# Altium project SDC_V2.1.PrjPcb (part 1 of 4)
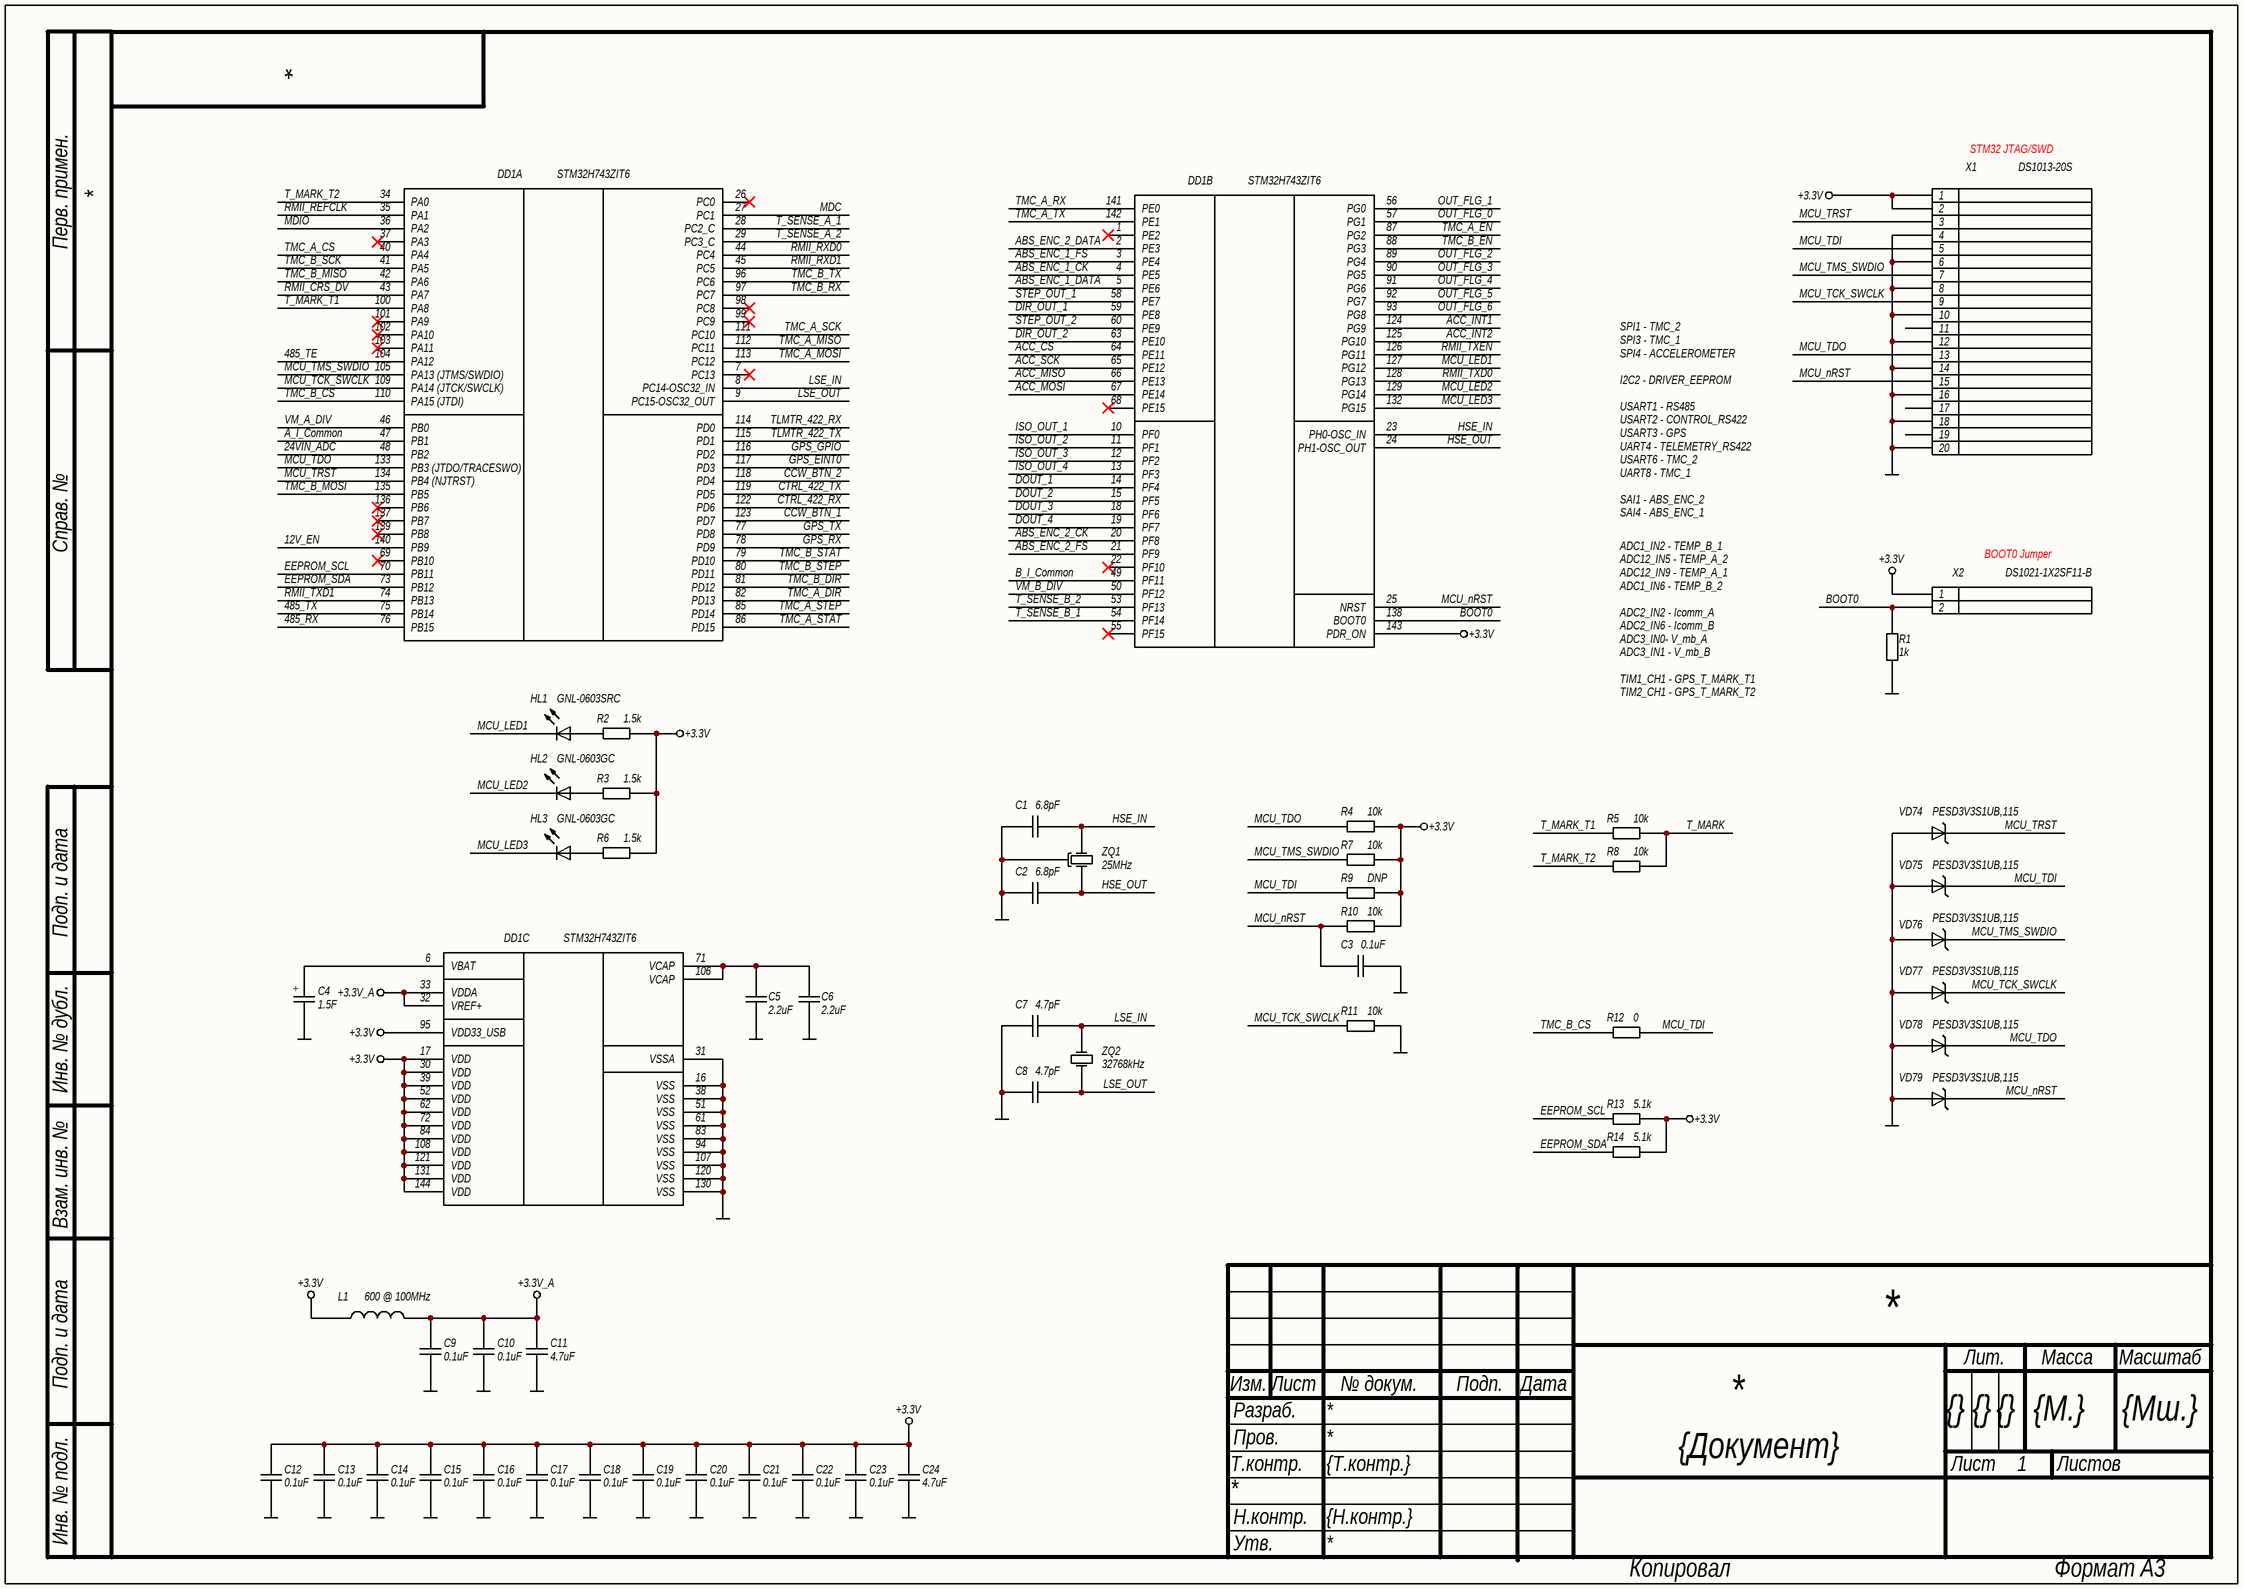
[diagram p0: MCU.SchDoc]
14 sheets, 622 parts. Net scope: global (net labels, ports and power ports of the same name join across sheets).
Board file: SDC_V2.1.PcbDoc
Sheets:
  MCU.SchDoc
  DRIVER_A.SchDoc
  DRIVER_B.SchDoc
  ABS_ENC_IF.SchDoc
  INC_ENC_IF.SchDoc
  CTRL_IF.SchDoc
  TELEM_IF.SchDoc
  RS485_IF.SchDoc
  DISCRETE_IF.SchDoc
  SNS_INPUT.SchDoc
  ETHERNET.SchDoc
  SENSORS.SchDoc
  POE.SchDoc
  POWER.SchDoc

## Sheet MCU.SchDoc
size 420 x 297 mm; SheetNumber: 1; Scale: {Мш.}; PageSetup: Record=PageOptions|CenterHorizontal=False|CenterVertical=False|PrintScale=0.49|XCorrection=0.00|YCorrection=0.00|PrintKind=1|BorderSize=5000000|LeftOffset=0|BottomOffset=0|Orientation=1|PaperLength=1000|PaperWidth=1000|Scale=100|PaperSource=15|PrintQuality=600|MediaType=1|DitherType=10|PrintScaleMode=1|PaperKind=A4; ProcessInspection: {Т.контр.}; Mass: {М.}; NormInspection: {Н.контр.}; Letter1Column: {}; Letter2Column: {}; Letter3Column: {}; DocumentType: {Документ}

### Parts
C1  6.8pF  [C0603N]
C2  6.8pF  [C0603N]
C3  0.1uF  [C0603N]
C4  1.5F  [KR-5R5H155-R]
C5  2.2uF  [C0603N]
C6  2.2uF  [C0603N]
C7  4.7pF  [C0603N]
C8  4.7pF  [C0603N]
C9  0.1uF  [C0603N]
C10  0.1uF  [C0603N]
C11  4.7uF  [C0603N]
C12  0.1uF  [C0603N]
C13  0.1uF  [C0603N]
C14  0.1uF  [C0603N]
C15  0.1uF  [C0603N]
C16  0.1uF  [C0603N]
C17  0.1uF  [C0603N]
C18  0.1uF  [C0603N]
C19  0.1uF  [C0603N]
C20  0.1uF  [C0603N]
C21  0.1uF  [C0603N]
C22  0.1uF  [C0603N]
C23  0.1uF  [C0603N]
C24  4.7uF  [C0603N]
DD1  STM32H743ZIT6  [LQFP144]  (parts A,B,C of 3)
HL1  GNL-0603SRC  [LED0603]
HL2  GNL-0603GC  [LED0603]
HL3  GNL-0603GC  [LED0603]
L1  600 @ 100MHz  [FB0603N]
R1  1k  [R0603N]
R2  1.5k  [R0603N]
R3  1.5k  [R0603N]
R4  10k  [R0603N]
R5  10k  [R0603N]
R6  1.5k  [R0603N]
R7  10k  [R0603N]
R8  10k  [R0603N]
R9  DNP  [R0603N]  (no BOM)
R10  10k  [R0603N]
R11  10k  [R0603N]
R12  0  [R0603N]
R13  5.1k  [R0603N]
R14  5.1k  [R0603N]
VD74  PESD3V3S1UB,115  [SOD523]
VD75  PESD3V3S1UB,115  [SOD523]
VD76  PESD3V3S1UB,115  [SOD523]
VD77  PESD3V3S1UB,115  [SOD523]
VD78  PESD3V3S1UB,115  [SOD523]
VD79  PESD3V3S1UB,115  [SOD523]
X1  DS1013-20S  [2.54_2X10_HEADER_BOX]
X2  DS1021-1X2SF11-B  [2.54_2X1_HEADER]
ZQ1  25MHz  [NX3225GA]
ZQ2  32768kHz  [NX3215SA]

### Nets
+3.3V: C12.2 C13.2 C14.2 C15.2 C16.2 C17.2 C18.2 C19.2 C20.2 C21.2 C22.2 C23.2 C24.2 DD1.17(VDD) DD1.30(VDD) DD1.39(VDD) DD1.52(VDD) DD1.62(VDD) DD1.72(VDD) DD1.84(VDD) DD1.95(VDD33_USB) DD1.108(VDD) DD1.121(VDD) DD1.131(VDD) DD1.143(PDR_ON) DD1.144(VDD) L1.1 R2.1 R3.1 R4.1 R6.1 R7.1 R9.1 R10.1 R13.1 R14.1 X1.1 X1.2 X2.1
+3.3V_A: C9.2 C10.2 C11.2 DD1.32(VREF+) DD1.33(VDDA) L1.2
GND: C1.2 C2.2 C3.1 C4.2 C5.1 C6.1 C7.2 C8.2 C9.1 C10.1 C11.1 C12.1 C13.1 C14.1 C15.1 C16.1 C17.1 C18.1 C19.1 C20.1 C21.1 C22.1 C23.1 C24.1 DD1.16(VSS) DD1.31(VSSA) DD1.38(VSS) DD1.51(VSS) DD1.61(VSS) DD1.83(VSS) DD1.94(VSS) DD1.107(VSS) DD1.120(VSS) DD1.130(VSS) R1.2 R11.2 VD74.2(A) VD75.2(A) VD76.2(A) VD77.2(A) VD78.2(A) VD79.2(A) X1.4 X1.6 X1.8 X1.10 X1.12 X1.14 X1.16 X1.18 X1.20 ZQ1.2
12V_EN: DD1.140(PB9)
24VIN_ADC: DD1.48(PB2)
485_RX: DD1.76(PB15)
485_TE: DD1.104(PA12)
485_TX: DD1.75(PB14)
A_I_Common: DD1.47(PB1)
ABS_ENC_1_CK: DD1.4(PE5)
ABS_ENC_1_DATA: DD1.5(PE6)
ABS_ENC_1_FS: DD1.3(PE4)
ABS_ENC_2_CK: DD1.20(PF8)
ABS_ENC_2_DATA: DD1.2(PE3)
ABS_ENC_2_FS: DD1.21(PF9)
ACC_CS: DD1.64(PE11)
ACC_INT1: DD1.124(PG9)
ACC_INT2: DD1.125(PG10)
ACC_MISO: DD1.66(PE13)
ACC_MOSI: DD1.67(PE14)
ACC_SCK: DD1.65(PE12)
B_I_Common: DD1.49(PF11)
BOOT0: DD1.138(BOOT0) R1.1 X2.2
CCW_BTN_1: DD1.123(PD7)
CCW_BTN_2: DD1.118(PD4)
CTRL_422_RX: DD1.122(PD6)
CTRL_422_TX: DD1.119(PD5)
DIR_OUT_1: DD1.59(PE8)
DIR_OUT_2: DD1.63(PE10)
DOUT_1: DD1.14(PF4)
DOUT_2: DD1.15(PF5)
DOUT_3: DD1.18(PF6)
DOUT_4: DD1.19(PF7)
EEPROM_SCL: DD1.70(PB11) R13.2
EEPROM_SDA: DD1.73(PB12) R14.2
GPS_EINT0: DD1.117(PD3)
GPS_GPIO: DD1.116(PD2)
GPS_RX: DD1.78(PD9)
GPS_TX: DD1.77(PD8)
HSE_IN: C1.1 DD1.23(PH0-OSC_IN) ZQ1.1
HSE_OUT: C2.1 DD1.24(PH1-OSC_OUT) ZQ1.3
ISO_OUT_1: DD1.10(PF0)
ISO_OUT_2: DD1.11(PF1)
ISO_OUT_3: DD1.12(PF2)
ISO_OUT_4: DD1.13(PF3)
LSE_IN: C7.1 DD1.8(PC14-OSC32_IN) ZQ2.2
LSE_OUT: C8.1 DD1.9(PC15-OSC32_OUT) ZQ2.1
MCU_LED1: DD1.127(PG12) HL1.1(K)
MCU_LED2: DD1.129(PG14) HL2.1(K)
MCU_LED3: DD1.132(PG15) HL3.1(K)
MCU_nRST: C3.2 DD1.25(NRST) R10.2 VD79.1(K) X1.15
MCU_TCK_SWCLK: DD1.109(PA14_(JTCK/SWCLK)) R11.1 VD77.1(K) X1.9
MCU_TDI: R9.2 R12.1 VD75.1(K) X1.5
MCU_TDO: DD1.133(PB3_(JTDO/TRACESWO)) R4.2 VD78.1(K) X1.13
MCU_TMS_SWDIO: DD1.105(PA13_(JTMS/SWDIO)) R7.2 VD76.1(K) X1.7
MCU_TRST: DD1.134(PB4_(NJTRST)) VD74.1(K) X1.3
MDC: DD1.27(PC1)
MDIO: DD1.36(PA2)
OUT_FLG_0: DD1.57(PG1)
OUT_FLG_1: DD1.56(PG0)
OUT_FLG_2: DD1.89(PG4)
OUT_FLG_3: DD1.90(PG5)
OUT_FLG_4: DD1.91(PG6)
OUT_FLG_5: DD1.92(PG7)
OUT_FLG_6: DD1.93(PG8)
RMII_CRS_DV: DD1.43(PA7)
RMII_REFCLK: DD1.35(PA1)
RMII_RXD0: DD1.44(PC4)
RMII_RXD1: DD1.45(PC5)
RMII_TXD0: DD1.128(PG13)
RMII_TXD1: DD1.74(PB13)
RMII_TXEN: DD1.126(PG11)
STEP_OUT_1: DD1.58(PE7)
STEP_OUT_2: DD1.60(PE9)
T_MARK: R5.2 R8.2
T_MARK_T1: DD1.100(PA8) R5.1
T_MARK_T2: DD1.34(PA0) R8.1
T_SENSE_A_1: DD1.28(PC2_C)
T_SENSE_A_2: DD1.29(PC3_C)
T_SENSE_B_1: DD1.54(PF14)
T_SENSE_B_2: DD1.53(PF13)
TLMTR_422_RX: DD1.114(PD0)
TLMTR_422_TX: DD1.115(PD1)
TMC_A_CS: DD1.40(PA4)
TMC_A_DIR: DD1.82(PD13)
TMC_A_EN: DD1.87(PG2)
TMC_A_MISO: DD1.112(PC11)
TMC_A_MOSI: DD1.113(PC12)
TMC_A_RX: DD1.141(PE0)
TMC_A_SCK: DD1.111(PC10)
TMC_A_STAT: DD1.86(PD15)
TMC_A_STEP: DD1.85(PD14)
TMC_A_TX: DD1.142(PE1)
TMC_B_CS: DD1.110(PA15_(JTDI)) R12.2
TMC_B_DIR: DD1.81(PD12)
TMC_B_EN: DD1.88(PG3)
TMC_B_MISO: DD1.42(PA6)
TMC_B_MOSI: DD1.135(PB5)
TMC_B_RX: DD1.97(PC7)
TMC_B_SCK: DD1.41(PA5)
TMC_B_STAT: DD1.79(PD10)
TMC_B_STEP: DD1.80(PD11)
TMC_B_TX: DD1.96(PC6)
VM_A_DIV: DD1.46(PB0)
VM_B_DIV: DD1.50(PF12)
NetC4_1: C4.1 DD1.6(VBAT)
NetC5_2: C5.2 C6.2 DD1.71(VCAP) DD1.106(VCAP)
NetHL1_2: HL1.2(A) R2.2
NetHL2_2: HL2.2(A) R3.2
NetHL3_2: HL3.2(A) R6.2

Not connected (* = marked no-connect by the designer): DD1 1(PE2)* 7(PC13)* 22(PF10)* 26(PC0)* 37(PA3)* 55(PF15)* 68(PE15)* 69(PB10)* 98(PC8)* 99(PC9)* 101(PA9)* 102(PA10)* 103(PA11)* 136(PB6)* 137(PB7)* 139(PB8)*; X1 11 17 19

### Notes on the sheet
- STM32 JTAG/SWD
- SPI1 - TMC_2
- SPI3 - TMC_1
- I2C2 - DRIVER_EEPROM
- SPI4 - ACCELEROMETER
- USART2 - CONTROL_RS422
- USART6 - TMC_2
- USART1 - RS485
- USART3 - GPS
- UART4 - TELEMETRY_RS422
- UART8 - TMC_1
- SAI1 - ABS_ENC_2
- SAI4 - ABS_ENC_1
- ADC1_IN2 - TEMP_B_1
- ADC12_IN5 - TEMP_A_2
- ADC12_IN9 - TEMP_A_1
- ADC1_IN6 - TEMP_B_2
- BOOT0 Jumper
- ADC2_IN2 - Icomm_A
- ADC2_IN6 - Icomm_B
- ADC3_IN0- V_mb_A
- ADC3_IN1 - V_mb_B
- TIM1_CH1 - GPS_T_MARK_T1
- TIM2_CH1 - GPS_T_MARK_T2
- Перв. примен.
- Справ. №
- Подп. и дата
- Инв. № дубл.
- Взам. инв. №
- Изм.
- Лист
- № докум.
- Подп.
- Дата
- Лит.
- Масса
- Масштаб
- Т.контр.
- Пров.
- Разраб.
- Листов
- Инв. № подл.
- Н.контр.
- Утв.
- Копировал
- Формат А3
- (in symbol KR-5R5H155-R) +

### Library data of the parts
C1 C2 = CC0603CRNPO9BN6R8: Конденсатор; Точность: ±0.25pF; Напряжение: 50V; Диэлектрик: NP0; Производитель: YAGEO; Описание: 6.8 pF ±0.25pF 50V Ceramic Capacitor C0G, NP0 0603 (1608 Metric); Корпус: 0603 (1608 Metric); Температурный диапазон: -55°C ~ 125°C; Вид монтажа: SMD; Артикул: CC0603CRNPO9BN6R8; Номинал: 6.8pF; Строка для документации: https://www.yageo.com/upload/media/product/productsearch/datasheet/mlcc/UPY-GP_NP0_16V-to-50V_18.pdf; Тип элемента: Конденсатор
C3 C9 C10 C12-C23 = CL10B104KB8NNNC: Конденсатор; Точность: 10%; Напряжение: 50V; Диэлектрик: X7R; Производитель: Samsung Electro-Mechanics; Описание: 0.1 µF ±10% 50V Ceramic Capacitor X7R 0603 (1608 Metric); Корпус: 0603 (1608 Metric); Температурный диапазон: -55°C ~ 125°C; Вид монтажа: SMD; Артикул: CL10B104KB8NNNC; Номинал: 0.1uF; Строка для документации: https://mm.digikey.com/Volume0/opasdata/d220001/medias/docus/609/CL10B104KB8NNNC_Spec.pdf; Тип элемента: Конденсатор
C4 = KR-5R5H155-R: Ионистор; Точность: -20%, +80%; Напряжение: 5.5V; Диэлектрик: EDLC; Производитель: Eaton - Electronics Division; Описание: 1.5 F (EDLC) Supercapacitor 5.5 V Axial, Can - Horizontal 30Ohm @ 1kHz 1000 Hrs @ 70°C; Корпус: 19.00mm dia x 6.5mm; Температурный диапазон: -25°C ~ 70°C; Вид монтажа: Through Hole; Тип элемента: Конденсатор; Артикул: KR-5R5H155-R; Номинал: 1.5F; Строка для документации: https://www.eaton.com/content/dam/eaton/products/electronic-components/resources/data-sheet/eaton-kr-supercapacitors-coin-cells-data-sheet.pdf
C5 C6 = CL10A225KO8NNNC: Конденсатор; Точность: 10%; Напряжение: 16V; Диэлектрик: X5R; Производитель: Samsung Electro-Mechanics; Описание: 2.2 µF ±10% 16V Ceramic Capacitor X5R 0603 (1608 Metric); Корпус: 0603 (1608 Metric); Температурный диапазон: -55°C ~ 85°C; Вид монтажа: SMD; Артикул: CL10A225KO8NNNC; Номинал: 2.2uF; Строка для документации: https://mm.digikey.com/Volume0/opasdata/d220001/medias/docus/421/CL10A225KO8NNNC_Spec.pdf; Тип элемента: Конденсатор
C7 C8 = CC0603CRNPO9BN4R7: Конденсатор; Точность: ±0.25pF; Напряжение: 50V; Диэлектрик: NP0; Производитель: YAGEO; Описание: 4.7 pF ±0.25pF 50V Ceramic Capacitor C0G, NP0 0603 (1608 Metric); Корпус: 0603 (1608 Metric); Температурный диапазон: -55°C ~ 125°C; Вид монтажа: SMD; Артикул: CC0603CRNPO9BN4R7; Номинал: 4.7pF; Строка для документации: https://www.yageo.com/upload/media/product/productsearch/datasheet/mlcc/UPY-GP_NP0_16V-to-50V_18.pdf; Тип элемента: Конденсатор
C11 C24 = CL10A475KO8NNNC: Конденсатор; Точность: 10%; Напряжение: 16V; Диэлектрик: X5R; Производитель: Samsung Electro-Mechanics; Описание: 4.7 µF ±10% 16V Ceramic Capacitor X5R 0603 (1608 Metric); Корпус: 0603 (1608 Metric); Температурный диапазон: -55°C ~ 85°C; Вид монтажа: SMD; Артикул: CL10A475KO8NNNC; Номинал: 4.7uF; Строка для документации: https://mm.digikey.com/Volume0/opasdata/d220001/medias/docus/2328/CL10A475KO8NNNC_Spec.pdf; Тип элемента: Конденсатор
DD1 = STM32H743ZIT6: Микросхема микроконтроллер; Производитель: STMicroelectronics; Описание: ARM® Cortex®-M7 STM32H7 Microcontroller IC 32-Bit Single-Core 480MHz 2MB (2M x 8) FLASH 144-LQFP (20x20); Корпус: 144-LQFP (20x20); Температурный диапазон: -40°C ~ 85°C (TA); Вид монтажа: SMD; Артикул: STM32H743ZIT6; Строка для документации: https://www.st.com/resource/en/datasheet/stm32h743bi.pdf; Тип элемента: Микросхема
HL1 = GNL-0603SRC: Светодиод; Прямой ток: 20mA; Напряжение: 2V; Яркость: 15mcd; Цвет: Зеленый; Длина волны: 660nm; Производитель: G-nor Electronics; Описание: Green 567nm LED Indication - Discrete 2V 0603 (1608 Metric); Корпус: 0603 (1608 Metric); Температурный диапазон: -40°C ~ 80°C; Вид монтажа: SMD; Тип элемента: Диод светоизлучающий; Артикул: GNL-0603SRC; Строка для документации: https://www.g-nor.com/Uploads/Ed/file/20210517/1621223120713818.doc
HL2 HL3 = GNL-0603GC: Светодиод; Прямой ток: 20mA; Напряжение: 2V; Яркость: 12mcd; Цвет: Зеленый; Длина волны: 567nm; Производитель: G-nor Electronics; Описание: Green 567nm LED Indication - Discrete 2V 0603 (1608 Metric); Корпус: 0603 (1608 Metric); Температурный диапазон: -40°C ~ 80°C; Вид монтажа: SMD; Тип элемента: Диод светоизлучающий; Артикул: GNL-0603GC; Строка для документации: https://www.g-nor.com/Uploads/Ed/file/20210517/1621223120713818.doc
L1 = BLM18AG601SN1D: Фильтр ЭМП индуктивный; Ток: 500mA; Сопротивление: 380m; Тип: Ferrite Bead; Производитель: Murata Electronics; Описание: 600 Ohms @ 100 MHz 1 Ferrite Bead 0603 (1608 Metric) 500mA 380mOhm; Корпус: 0603 (1608 Metric); Температурный диапазон: -55°C ~ 125°C; Вид монтажа: SMD; Артикул: BLM18AG601SN1D; Номинал: 600 @ 100MHz; Строка для документации: https://www.murata.com/en-us/products/productdata/8796738650142/ENFA0003.pdf; Тип элемента: Фильтр ЭМП
R1 = RC0603FR-071KL: Резистор; Точность: 1%; ТКС: ±100ppm/°C; Напряжение: 75V; Производитель: YAGEO; Описание: 1 kOhms ±1% 0.1W, 1/10W Chip Resistor 0603 (1608 Metric) Moisture Resistant Thick Film; Корпус: 0603 (1608 Metric); Температурный диапазон: -55°C ~ 155°C; Вид монтажа: SMD; Артикул: RC0603FR-071KL; Номинал: 1k; Строка для документации: https://www.yageo.com/upload/media/product/app/datasheet/rchip/pyu-rc_group_51_rohs_l.pdf; Тип элемента: Резистор
R2 R3 R6 = RC0603FR-071K5L: Резистор; Точность: 1%; ТКС: ±100ppm/°C; Напряжение: 75V; Производитель: YAGEO; Описание: 1.5 kOhms ±1% 0.1W, 1/10W Chip Resistor 0603 (1608 Metric) Moisture Resistant Thick Film; Корпус: 0603 (1608 Metric); Температурный диапазон: -55°C ~ 155°C; Вид монтажа: SMD; Артикул: RC0603FR-071K5L; Номинал: 1.5k; Строка для документации: https://www.yageo.com/upload/media/product/app/datasheet/rchip/pyu-rc_group_51_rohs_l.pdf; Тип элемента: Резистор
R4 R5 R7-R11 = RC0603FR-0710KL: Резистор; Точность: 1%; ТКС: ±100ppm/°C; Напряжение: 75V; Производитель: YAGEO; Описание: 10 kOhms ±1% 0.1W, 1/10W Chip Resistor 0603 (1608 Metric) Moisture Resistant Thick Film; Корпус: 0603 (1608 Metric); Температурный диапазон: -55°C ~ 155°C; Вид монтажа: SMD; Артикул: RC0603FR-0710KL; Строка для документации: https://www.yageo.com/upload/media/product/app/datasheet/rchip/pyu-rc_group_51_rohs_l.pdf; Тип элемента: Резистор
  R4 R5 R7 R8 R10 R11: Номинал: 10k
  R9: Номинал: DNP
R12 = RC0603FR-070RL: Резистор; Точность: 1%; Напряжение: 75V; Производитель: YAGEO; Описание: 0 Ohms Jumper Chip Resistor 0603 (1608 Metric) Moisture Resistant Thick Film; Корпус: 0603 (1608 Metric); Температурный диапазон: -55°C ~ 155°C; Вид монтажа: SMD; Артикул: RC0603FR-070RL; Номинал: 0; Строка для документации: https://www.yageo.com/upload/media/product/app/datasheet/rchip/pyu-rc_group_51_rohs_l.pdf; Тип элемента: Резистор
R13 R14 = RC0603FR-075K1L: Резистор; Точность: 1%; ТКС: ±100ppm/°C; Напряжение: 75V; Производитель: YAGEO; Описание: 5.1 kOhms ±1% 0.1W, 1/10W Chip Resistor 0603 (1608 Metric) Moisture Resistant Thick Film; Корпус: 0603 (1608 Metric); Температурный диапазон: -55°C ~ 155°C; Вид монтажа: SMD; Артикул: RC0603FR-075K1L; Номинал: 5.1k; Строка для документации: https://www.yageo.com/upload/media/product/app/datasheet/rchip/pyu-rc_group_51_rohs_l.pdf; Тип элемента: Резистор
VD74-VD79 = PESD3V3S1UB,115: TVS диод однонаправлвенный; Напряжение: 5V; Напряжение ограничения: 20V; Напряжение пробоя: 5.2V; Ток: 18A; Тип: TVS Unidirectional; Производитель: Nexperia USA Inc.; Описание: 20V Clamp 18A (8/20µs) Ipp Tvs Diode Surface Mount SOD-523; Корпус: SC-79, SOD-523; Температурный диапазон: -65°C ~ 150°C (TA); Вид монтажа: SMD; Тип элемента: Диод защитный; Артикул: PESD3V3S1UB,115; Строка для документации: https://assets.nexperia.com/documents/data-sheet/PESD3V3S1UB.pdf
X1 = DS1013-20S: Разъем, 20 контактов; Тип разъема: Header, Male Pin; Количество контактов: 20; Шаг контактов: 2.54mm; Ток: 3A; Напряжение: 250V; Производитель: Connfly electronic (Zhenqin); Описание: Connector Header Through Hole 30 position 0.100" (2.54mm); Температурный диапазон: -40°C ~ 105°C; Вид монтажа: Through Hole; Артикул: DS1013-20S; Строка для документации: http://cn.connfly.group/static/upload/file/pdf/DS1013.pdf; Тип элемента: Разъем
X2 = DS1021-1X2SF11-B: Разъем, 2 контакта; Тип разъема: Header, Male Pin; Количество контактов: 2; Шаг контактов: 2.54mm; Ток: 3A; Напряжение: 250V; Производитель: Connfly electronic (Zhenqin); Описание: Connector Header Through Hole 2 position 0.100" (2.54mm); Температурный диапазон: -40°C ~ 105°C; Вид монтажа: Through Hole; Артикул: DS1021-1X2SF11-B; Строка для документации: http://cn.connfly.group/static/upload/file/pdf/DS1021.pdf; Тип элемента: Разъем
ZQ1 = NX3225GA-25.000M: Кварцевый резонатор, экранированный; Точность: ±20ppm; Описание: 25 MHz ±20ppm Crystal 8pF 50 Ohms 4-SMD, No Lead; Тип: MHz Crystal; Производитель: NDK America, Inc.; Температурный диапазон: -40°C ~ 85°C; Корпус: 3.20mm x 2.50mm; Вид монтажа: SMD; Артикул: NX3225GA-25.000M; Частота: 25MHz; Строка для документации: https://www.ndk.com/en/products/upload/lineup/pdf/NDKX03-00006_en.pdf; Тип элемента: Кварцевый резонатор
ZQ2 = NX3215SA-32.768K: Кварцевый резонатор; Точность: ±20ppm; Описание: 32.768 kHz ±20ppm Crystal 7pF 70 kOhms 2-SMD, No Lead; Тип: kHz Crystal (Tuning Fork); Производитель: NDK America, Inc.; Температурный диапазон: -40°C ~ 85°C; Корпус: 3.20mm x 1.50mm; Вид монтажа: SMD; Артикул: NX3215SA-32.768K; Частота: 32768kHz; Строка для документации: https://www.ndk.com/images/products/catalog/c_NX3215SA_e.pdf; Тип элемента: Кварцевый резонатор

## Sheet DRIVER_A.SchDoc
size 420 x 297 mm; SheetNumber: 2; PageSetup: Record=PageOptions|CenterHorizontal=False|CenterVertical=False|PrintScale=0.95|XCorrection=0.00|YCorrection=0.00|PrintKind=1|BorderSize=5000000|LeftOffset=0|BottomOffset=0|Orientation=1|PaperLength=1000|PaperWidth=1000|Scale=100|PaperSource=15|PrintQuality=600|MediaType=1|DitherType=10|PaperKind=A4|PrintScaleMode=1
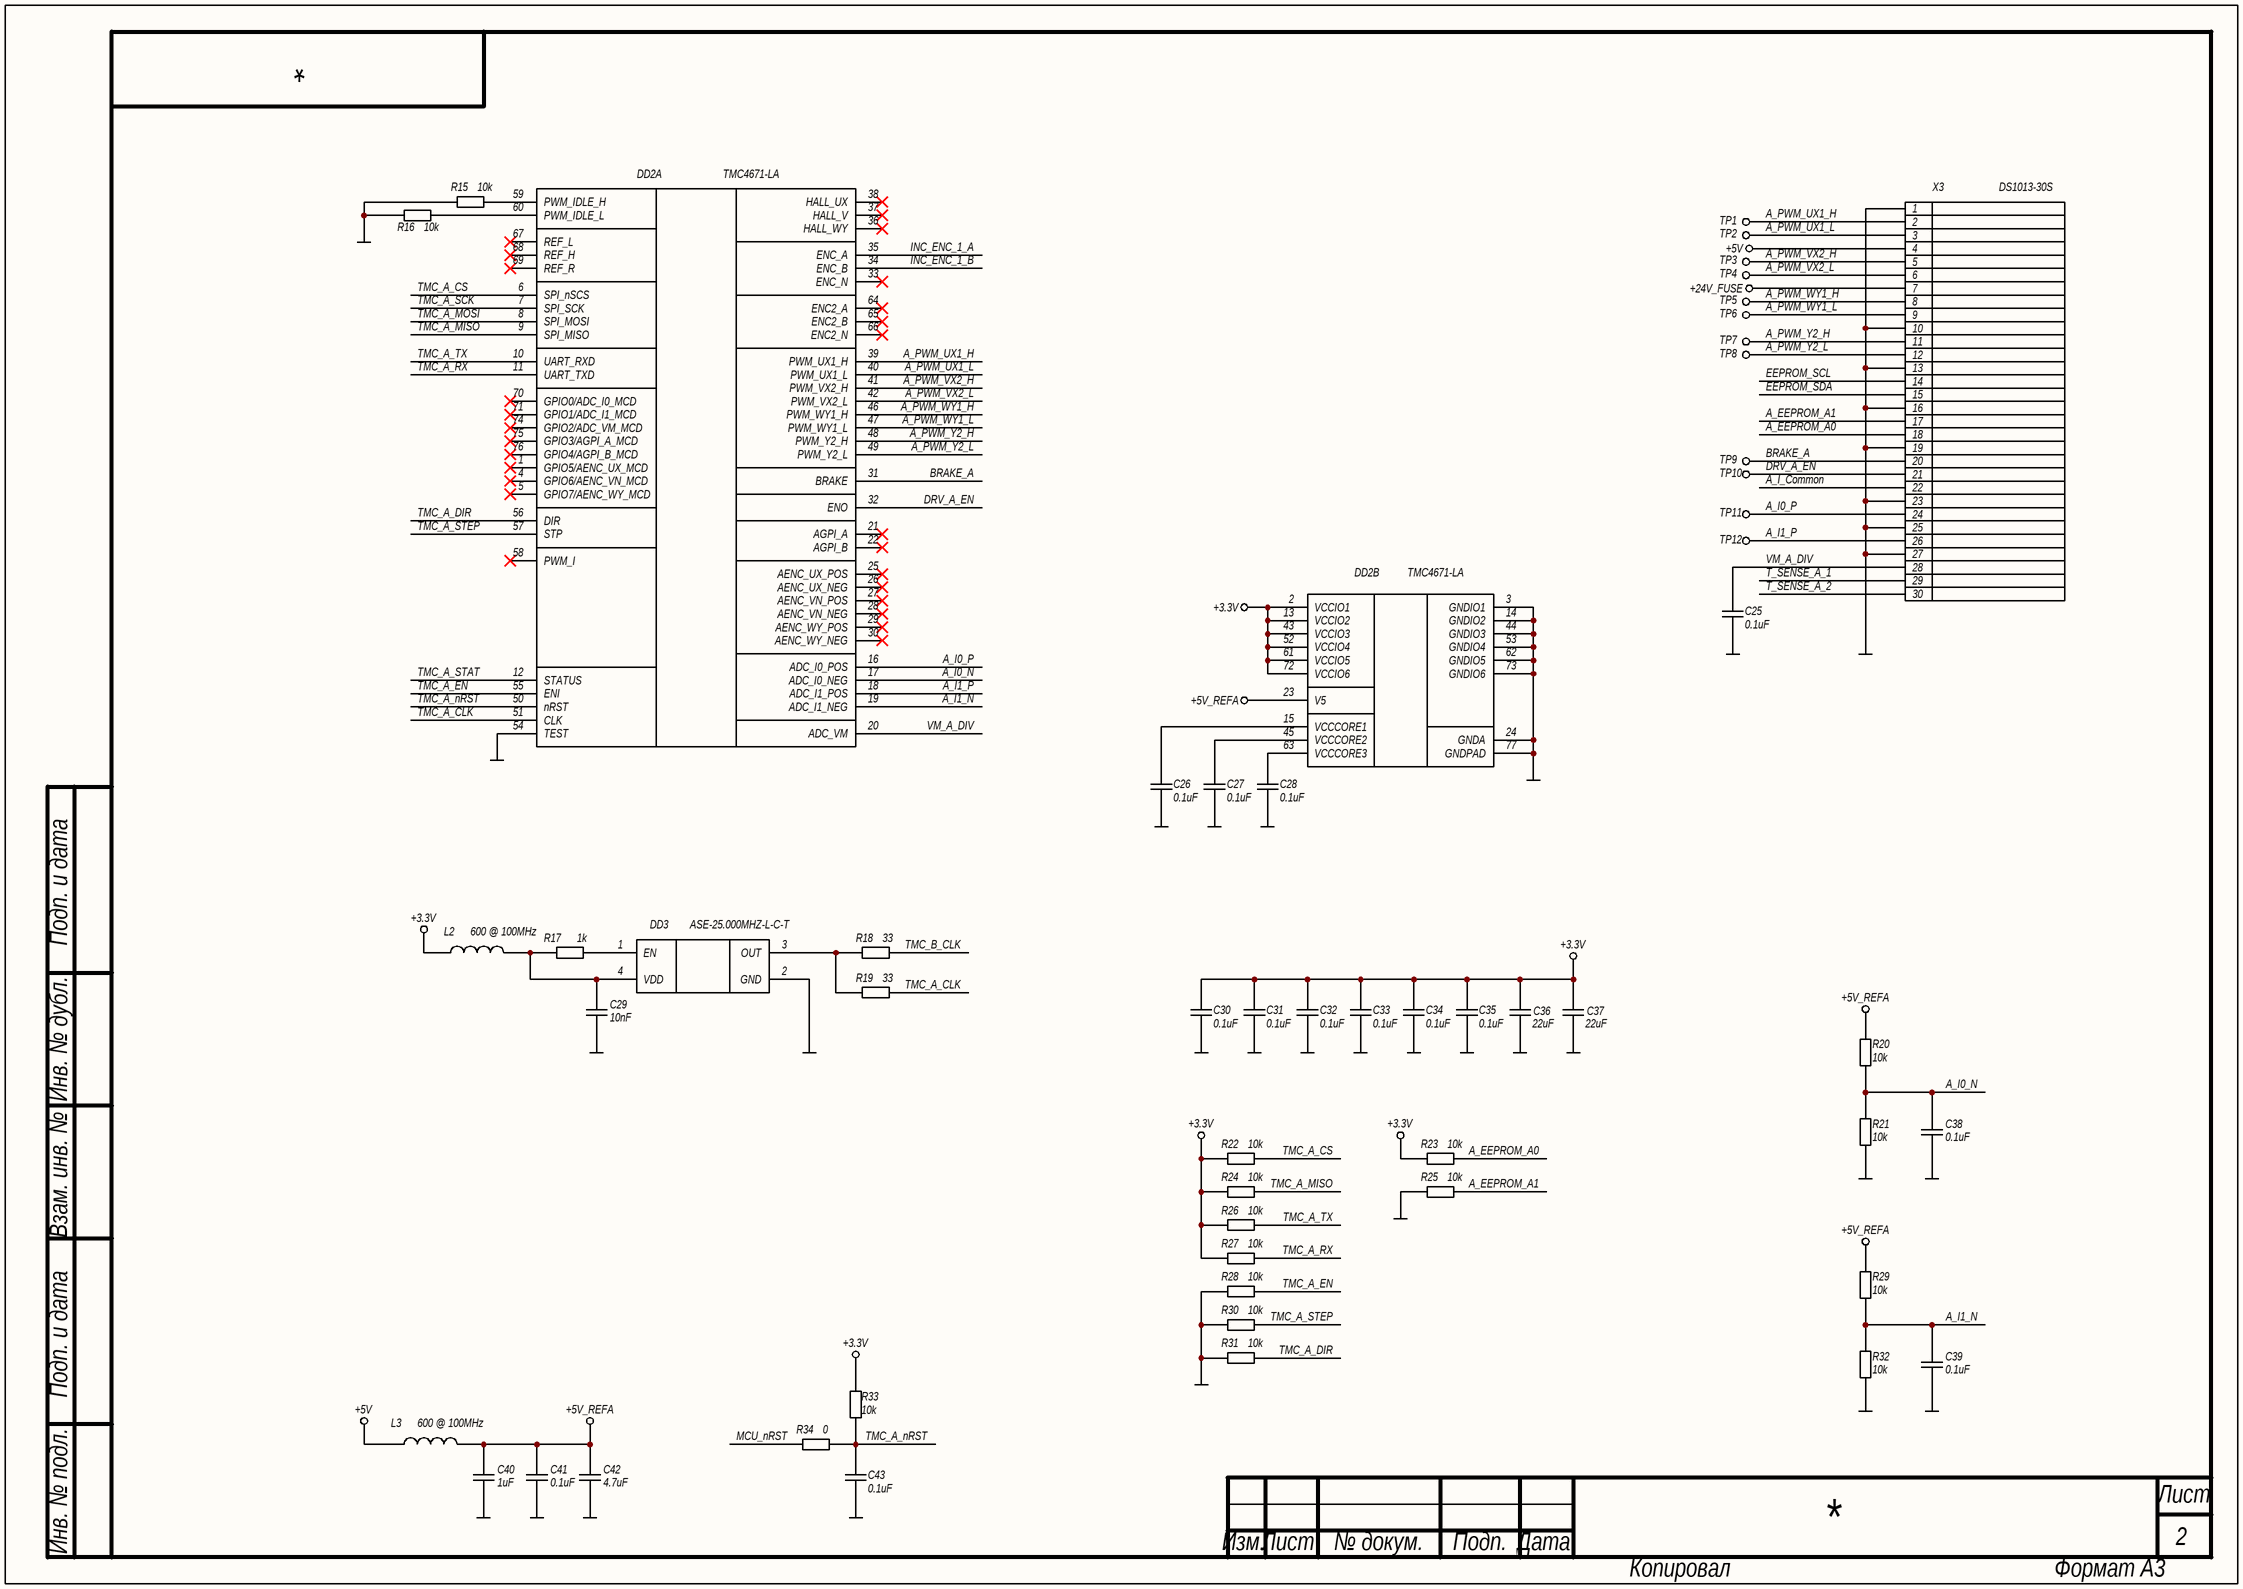
[diagram p1: DRIVER_A.SchDoc]

### Parts
C25  0.1uF  [C0603N]
C26  0.1uF  [C0603N]
C27  0.1uF  [C0603N]
C28  0.1uF  [C0603N]
C29  10nF  [C0603N]
C30  0.1uF  [C0603N]
C31  0.1uF  [C0603N]
C32  0.1uF  [C0603N]
C33  0.1uF  [C0603N]
C34  0.1uF  [C0603N]
C35  0.1uF  [C0603N]
C36  22uF  [C0805N]
C37  22uF  [C0805N]
C38  0.1uF  [C0603N]
C39  0.1uF  [C0603N]
C40  1uF  [C0603N]
C41  0.1uF  [C0603N]
C42  4.7uF  [C0603N]
C43  0.1uF  [C0603N]
DD2  TMC4671-LA  [QFN76-EP]  (parts A,B of 2)
DD3  ASE-25.000MHZ-L-C-T  [ASE]
L2  600 @ 100MHz  [FB0603N]
L3  600 @ 100MHz  [FB0603N]
R15  10k  [R0603N]
R16  10k  [R0603N]
R17  1k  [R0603N]
R18  33  [R0603N]
R19  33  [R0603N]
R20  10k  [R0603N]
R21  10k  [R0603N]
R22  10k  [R0603N]
R23  10k  [R0603N]
R24  10k  [R0603N]
R25  10k  [R0603N]
R26  10k  [R0603N]
R27  10k  [R0603N]
R28  10k  [R0603N]
R29  10k  [R0603N]
R30  10k  [R0603N]
R31  10k  [R0603N]
R32  10k  [R0603N]
R33  10k  [R0603N]
R34  0  [R0603N]
TP1  TEST_POINT  [TP_RPAD_0.8MM]  (value not drawn)  (no BOM)
TP2  TEST_POINT  [TP_RPAD_0.8MM]  (value not drawn)  (no BOM)
TP3  TEST_POINT  [TP_RPAD_0.8MM]  (value not drawn)  (no BOM)
TP4  TEST_POINT  [TP_RPAD_0.8MM]  (value not drawn)  (no BOM)
TP5  TEST_POINT  [TP_RPAD_0.8MM]  (value not drawn)  (no BOM)
TP6  TEST_POINT  [TP_RPAD_0.8MM]  (value not drawn)  (no BOM)
TP7  TEST_POINT  [TP_RPAD_0.8MM]  (value not drawn)  (no BOM)
TP8  TEST_POINT  [TP_RPAD_0.8MM]  (value not drawn)  (no BOM)
TP9  TEST_POINT  [TP_RPAD_0.8MM]  (value not drawn)  (no BOM)
TP10  TEST_POINT  [TP_RPAD_0.8MM]  (value not drawn)  (no BOM)
TP11  TEST_POINT  [TP_RPAD_0.8MM]  (value not drawn)  (no BOM)
TP12  TEST_POINT  [TP_RPAD_0.8MM]  (value not drawn)  (no BOM)
X3  DS1013-30S  [2.54_2X15_HEADER_BOX]

### Nets
+3.3V: C30.2 C31.2 C32.2 C33.2 C34.2 C35.2 C36.2 C37.2 DD2.2(VCCIO1) DD2.13(VCCIO2) DD2.43(VCCIO3) DD2.52(VCCIO4) DD2.61(VCCIO5) DD2.72(VCCIO6) L2.2 R22.2 R23.2 R24.2 R26.2 R27.2 R33.2
+5V: L3.1 X3.4
+5V_REFA: C40.2 C41.2 C42.2 DD2.23(V5) L3.2 R20.2 R29.2
+24V_FUSE: X3.7
GND: C25.1 C26.1 C27.1 C28.1 C29.2 C30.1 C31.1 C32.1 C33.1 C34.1 C35.1 C36.1 C37.1 C38.1 C39.1 C40.1 C41.1 C42.1 C43.1 DD2.3(GNDIO1) DD2.14(GNDIO2) DD2.24(GNDA) DD2.44(GNDIO3) DD2.53(GNDIO4) DD2.54(TEST) DD2.62(GNDIO5) DD2.73(GNDIO6) DD2.77(GNDPAD) DD3.2(GND) R15.2 R16.2 R21.1 R25.2 R28.2 R30.2 R31.2 R32.1 X3.1 X3.10 X3.13 X3.16 X3.19 X3.23 X3.25 X3.27
A_EEPROM_A0: R23.1 X3.18
A_EEPROM_A1: R25.1 X3.17
A_I0_N: C38.2 DD2.17(ADC_I0_NEG) R20.1 R21.2
A_I0_P: DD2.16(ADC_I0_POS) TP11.1 X3.24
A_I1_N: C39.2 DD2.19(ADC_I1_NEG) R29.1 R32.2
A_I1_P: DD2.18(ADC_I1_POS) TP12.1 X3.26
A_I_Common: X3.22
A_PWM_UX1_H: DD2.39(PWM_UX1_H) TP1.1 X3.2
A_PWM_UX1_L: DD2.40(PWM_UX1_L) TP2.1 X3.3
A_PWM_VX2_H: DD2.41(PWM_VX2_H) TP3.1 X3.5
A_PWM_VX2_L: DD2.42(PWM_VX2_L) TP4.1 X3.6
A_PWM_WY1_H: DD2.46(PWM_WY1_H) TP5.1 X3.8
A_PWM_WY1_L: DD2.47(PWM_WY1_L) TP6.1 X3.9
A_PWM_Y2_H: DD2.48(PWM_Y2_H) TP7.1 X3.11
A_PWM_Y2_L: DD2.49(PWM_Y2_L) TP8.1 X3.12
BRAKE_A: DD2.31(BRAKE) TP9.1 X3.20
DRV_A_EN: DD2.32(ENO) TP10.1 X3.21
EEPROM_SCL: X3.14
EEPROM_SDA: X3.15
INC_ENC_1_A: DD2.35(ENC_A)
INC_ENC_1_B: DD2.34(ENC_B)
MCU_nRST: R34.2
T_SENSE_A_1: X3.29
T_SENSE_A_2: X3.30
TMC_A_CLK: DD2.51(CLK) R19.1
TMC_A_CS: DD2.6(SPI_nSCS) R22.1
TMC_A_DIR: DD2.56(DIR) R31.1
TMC_A_EN: DD2.55(ENI) R28.1
TMC_A_MISO: DD2.9(SPI_MISO) R24.1
TMC_A_MOSI: DD2.8(SPI_MOSI)
TMC_A_nRST: C43.2 DD2.50(nRST) R33.1 R34.1
TMC_A_RX: DD2.11(UART_TXD) R27.1
TMC_A_SCK: DD2.7(SPI_SCK)
TMC_A_STAT: DD2.12(STATUS)
TMC_A_STEP: DD2.57(STP) R30.1
TMC_A_TX: DD2.10(UART_RXD) R26.1
TMC_B_CLK: R18.1
VM_A_DIV: C25.2 DD2.20(ADC_VM) X3.28
NetC26_2: C26.2 DD2.15(VCCCORE1)
NetC27_2: C27.2 DD2.45(VCCCORE2)
NetC28_2: C28.2 DD2.63(VCCCORE3)
NetC29_1: C29.1 DD3.4(VDD) L2.1 R17.1
NetDD2_59: DD2.59(PWM_IDLE_H) R15.1
NetDD2_60: DD2.60(PWM_IDLE_L) R16.1
NetDD3_1: DD3.1(EN) R17.2
NetDD3_3: DD3.3(OUT) R18.2 R19.2

Not connected (* = marked no-connect by the designer): DD2 1(GPIO5/AENC_UX_MCD)* 4(GPIO6/AENC_VN_MCD)* 5(GPIO7/AENC_WY_MCD)* 21(AGPI_A)* 22(AGPI_B)* 25(AENC_UX_POS)* 26(AENC_UX_NEG)* 27(AENC_VN_POS)* 28(AENC_VN_NEG)* 29(AENC_WY_POS)* 30(AENC_WY_NEG)* 33(ENC_N)* 36(HALL_WY)* 37(HALL_V)* 38(HALL_UX)* 58(PWM_I)* 64(ENC2_A)* 65(ENC2_B)* 66(ENC2_N)* 67(REF_L)* 68(REF_H)* 69(REF_R)* 70(GPIO0/ADC_I0_MCD)* 71(GPIO1/ADC_I1_MCD)* 74(GPIO2/ADC_VM_MCD)* 75(GPIO3/AGPI_A_MCD)* 76(GPIO4/AGPI_B_MCD)*

### Notes on the sheet
- Подп. и дата
- Инв. № дубл.
- Взам. инв. №
- Инв. № подл.
- Лист
- Изм.
- № докум.
- Подп.
- Дата
- Копировал
- Формат А3

### Library data of the parts
C25-C28 C30-C35 C38 C39 C41 C43 = CL10B104KB8NNNC: as C3 on sheet MCU; Артикул: CL10B104KB8NNNC; Номинал: 0.1uF; Строка для документации: https://mm.digikey.com/Volume0/opasdata/d220001/medias/docus/609/CL10B104KB8NNNC_Spec.pdf; Тип элемента: Конденсатор
C29 = CL10B103KB8NNNC: Конденсатор; Точность: 10%; Напряжение: 16V; Диэлектрик: X7R; Производитель: Samsung Electro-Mechanics; Описание: 10000 pF ±10% 50V Ceramic Capacitor X7R 0603 (1608 Metric); Корпус: 0603 (1608 Metric); Температурный диапазон: -55°C ~ 125°C; Вид монтажа: SMD; Артикул: CL10B103KB8NNNC; Номинал: 10nF; Строка для документации: https://mm.digikey.com/Volume0/opasdata/d220001/medias/docus/609/CL10B103KB8NNNC_Spec.pdf; Тип элемента: Конденсатор
C36 C37 = CL21A226MOCLRNC: Конденсатор; Точность: 20%; Напряжение: 16V; Диэлектрик: X5R; Производитель: Samsung Electro-Mechanics; Описание: 22 µF ±20% 16V Ceramic Capacitor X5R 0805 (2012 Metric); Корпус: 0805 (2012 Metric); Температурный диапазон: -55°C ~ 85°C; Вид монтажа: SMD; Артикул: CL21A226MOCLRNC; Номинал: 22uF; Строка для документации: https://mm.digikey.com/Volume0/opasdata/d220001/medias/docus/43/CL21A226MOCLRNC_Spec.pdf; Тип элемента: Конденсатор
C40 = CL10B105KO8NNNC: Конденсатор; Точность: 10%; Напряжение: 16V; Диэлектрик: X7R; Производитель: YAGEO; Описание: 1 µF ±10% 16V Ceramic Capacitor X7R 0603 (1608 Metric); Корпус: 0603 (1608 Metric); Температурный диапазон: -55°C ~ 125°C; Вид монтажа: SMD; Артикул: CL10B105KO8NNNC; Номинал: 1uF; Строка для документации: https://weblib.samsungsem.com/mlcc/mlcc-ec-data-sheet.do?partNumber=CL10B105KO8NNN; Тип элемента: Конденсатор
C42 = CL10A475KO8NNNC: as C11 on sheet MCU; Артикул: CL10A475KO8NNNC; Номинал: 4.7uF; Строка для документации: https://mm.digikey.com/Volume0/opasdata/d220001/medias/docus/2328/CL10A475KO8NNNC_Spec.pdf; Тип элемента: Конденсатор
DD2 = TMC4671-LA: Микросхема драйвер двигателя; Производитель: Analog Devices Inc.; Описание: Multiphase Motor Driver Power MOSFET SPI, Step/Direction 76-QFN (10.5x6.5); Корпус: 76-VFQFN Exposed Pad; Температурный диапазон: -40°C ~ 125°C (TJ); Вид монтажа: SMD; Артикул: TMC4671-LA; Строка для документации: https://www.analog.com/media/en/technical-documentation/data-sheets/TMC4671-LA_datasheet_Rev2.07.pdf; Тип элемента: Микросхема
DD3 = ASE-25.000MHZ-L-C-T: Кварцевый генератор; Частота: 25MHz; Точность: ±50ppm; Описание: 25 MHz XO (Standard) CMOS Oscillator 3.3V Enable/Disable 4-SMD, No Lead; Тип: XO (Standard); Производитель: Abracon LLC; Температурный диапазон: -40°C ~ 85°C; Корпус: 3.20mm x 2.50mm; Вид монтажа: SMD; Артикул: ASE-25.000MHZ-L-C-T; Строка для документации: https://abracon.com/Oscillators/ASEseries.pdf; Тип элемента: Кварцевый генератор
L2 L3 = BLM18AG601SN1D: as L1 on sheet MCU; Артикул: BLM18AG601SN1D; Номинал: 600 @ 100MHz; Строка для документации: https://www.murata.com/en-us/products/productdata/8796738650142/ENFA0003.pdf; Тип элемента: Фильтр ЭМП
R15 R16 R20-R33 = RC0603FR-0710KL: as R4 on sheet MCU; Артикул: RC0603FR-0710KL; Номинал: 10k; Строка для документации: https://www.yageo.com/upload/media/product/app/datasheet/rchip/pyu-rc_group_51_rohs_l.pdf; Тип элемента: Резистор
R17 = RC0603FR-071KL: as R1 on sheet MCU; Артикул: RC0603FR-071KL; Номинал: 1k; Строка для документации: https://www.yageo.com/upload/media/product/app/datasheet/rchip/pyu-rc_group_51_rohs_l.pdf; Тип элемента: Резистор
R18 R19 = RC0603FR-0733RL: Резистор; Точность: 1%; ТКС: ±100ppm/°C; Напряжение: 75V; Производитель: YAGEO; Описание: 33 Ohms ±1% 0.1W, 1/10W Chip Resistor 0603 (1608 Metric) Moisture Resistant Thick Film; Корпус: 0603 (1608 Metric); Температурный диапазон: -55°C ~ 155°C; Вид монтажа: SMD; Артикул: RC0603FR-0733RL; Номинал: 33; Строка для документации: https://www.yageo.com/upload/media/product/app/datasheet/rchip/pyu-rc_group_51_rohs_l.pdf; Тип элемента: Резистор
R34 = RC0603FR-070RL: as R12 on sheet MCU; Артикул: RC0603FR-070RL; Номинал: 0; Строка для документации: https://www.yageo.com/upload/media/product/app/datasheet/rchip/pyu-rc_group_51_rohs_l.pdf; Тип элемента: Резистор
TP1-TP12 = Test Point, Round Pad, 0.8mm diameter: Контрольная точка; Количество контактов: 1; Тип элемента: Разъем; Артикул: Test Point, Round Pad, 0.8mm diameter; Тип разъема: Test Point; Описание: Test Point, Round Pad, 0.8mm diameter
X3 = DS1013-30S: Разъем, 30 контактов; Тип разъема: Header, Male Pin; Количество контактов: 30; Шаг контактов: 2.54mm; Ток: 3A; Напряжение: 250V; Производитель: Connfly electronic (Zhenqin); Описание: Connector Header Through Hole 30 position 0.100" (2.54mm); Температурный диапазон: -40°C ~ 105°C; Вид монтажа: Through Hole; Артикул: DS1013-30S; Строка для документации: http://cn.connfly.group/static/upload/file/pdf/DS1013.pdf; Тип элемента: Разъем

## Sheet DRIVER_B.SchDoc
size 420 x 297 mm; SheetNumber: 3; PageSetup: Record=PageOptions|CenterHorizontal=False|CenterVertical=False|PrintScale=0.95|XCorrection=0.00|YCorrection=0.00|PrintKind=1|BorderSize=5000000|LeftOffset=0|BottomOffset=0|Orientation=1|PaperLength=1000|PaperWidth=1000|Scale=100|PaperSource=15|PrintQuality=600|MediaType=1|DitherType=10|PaperKind=A4|PrintScaleMode=1
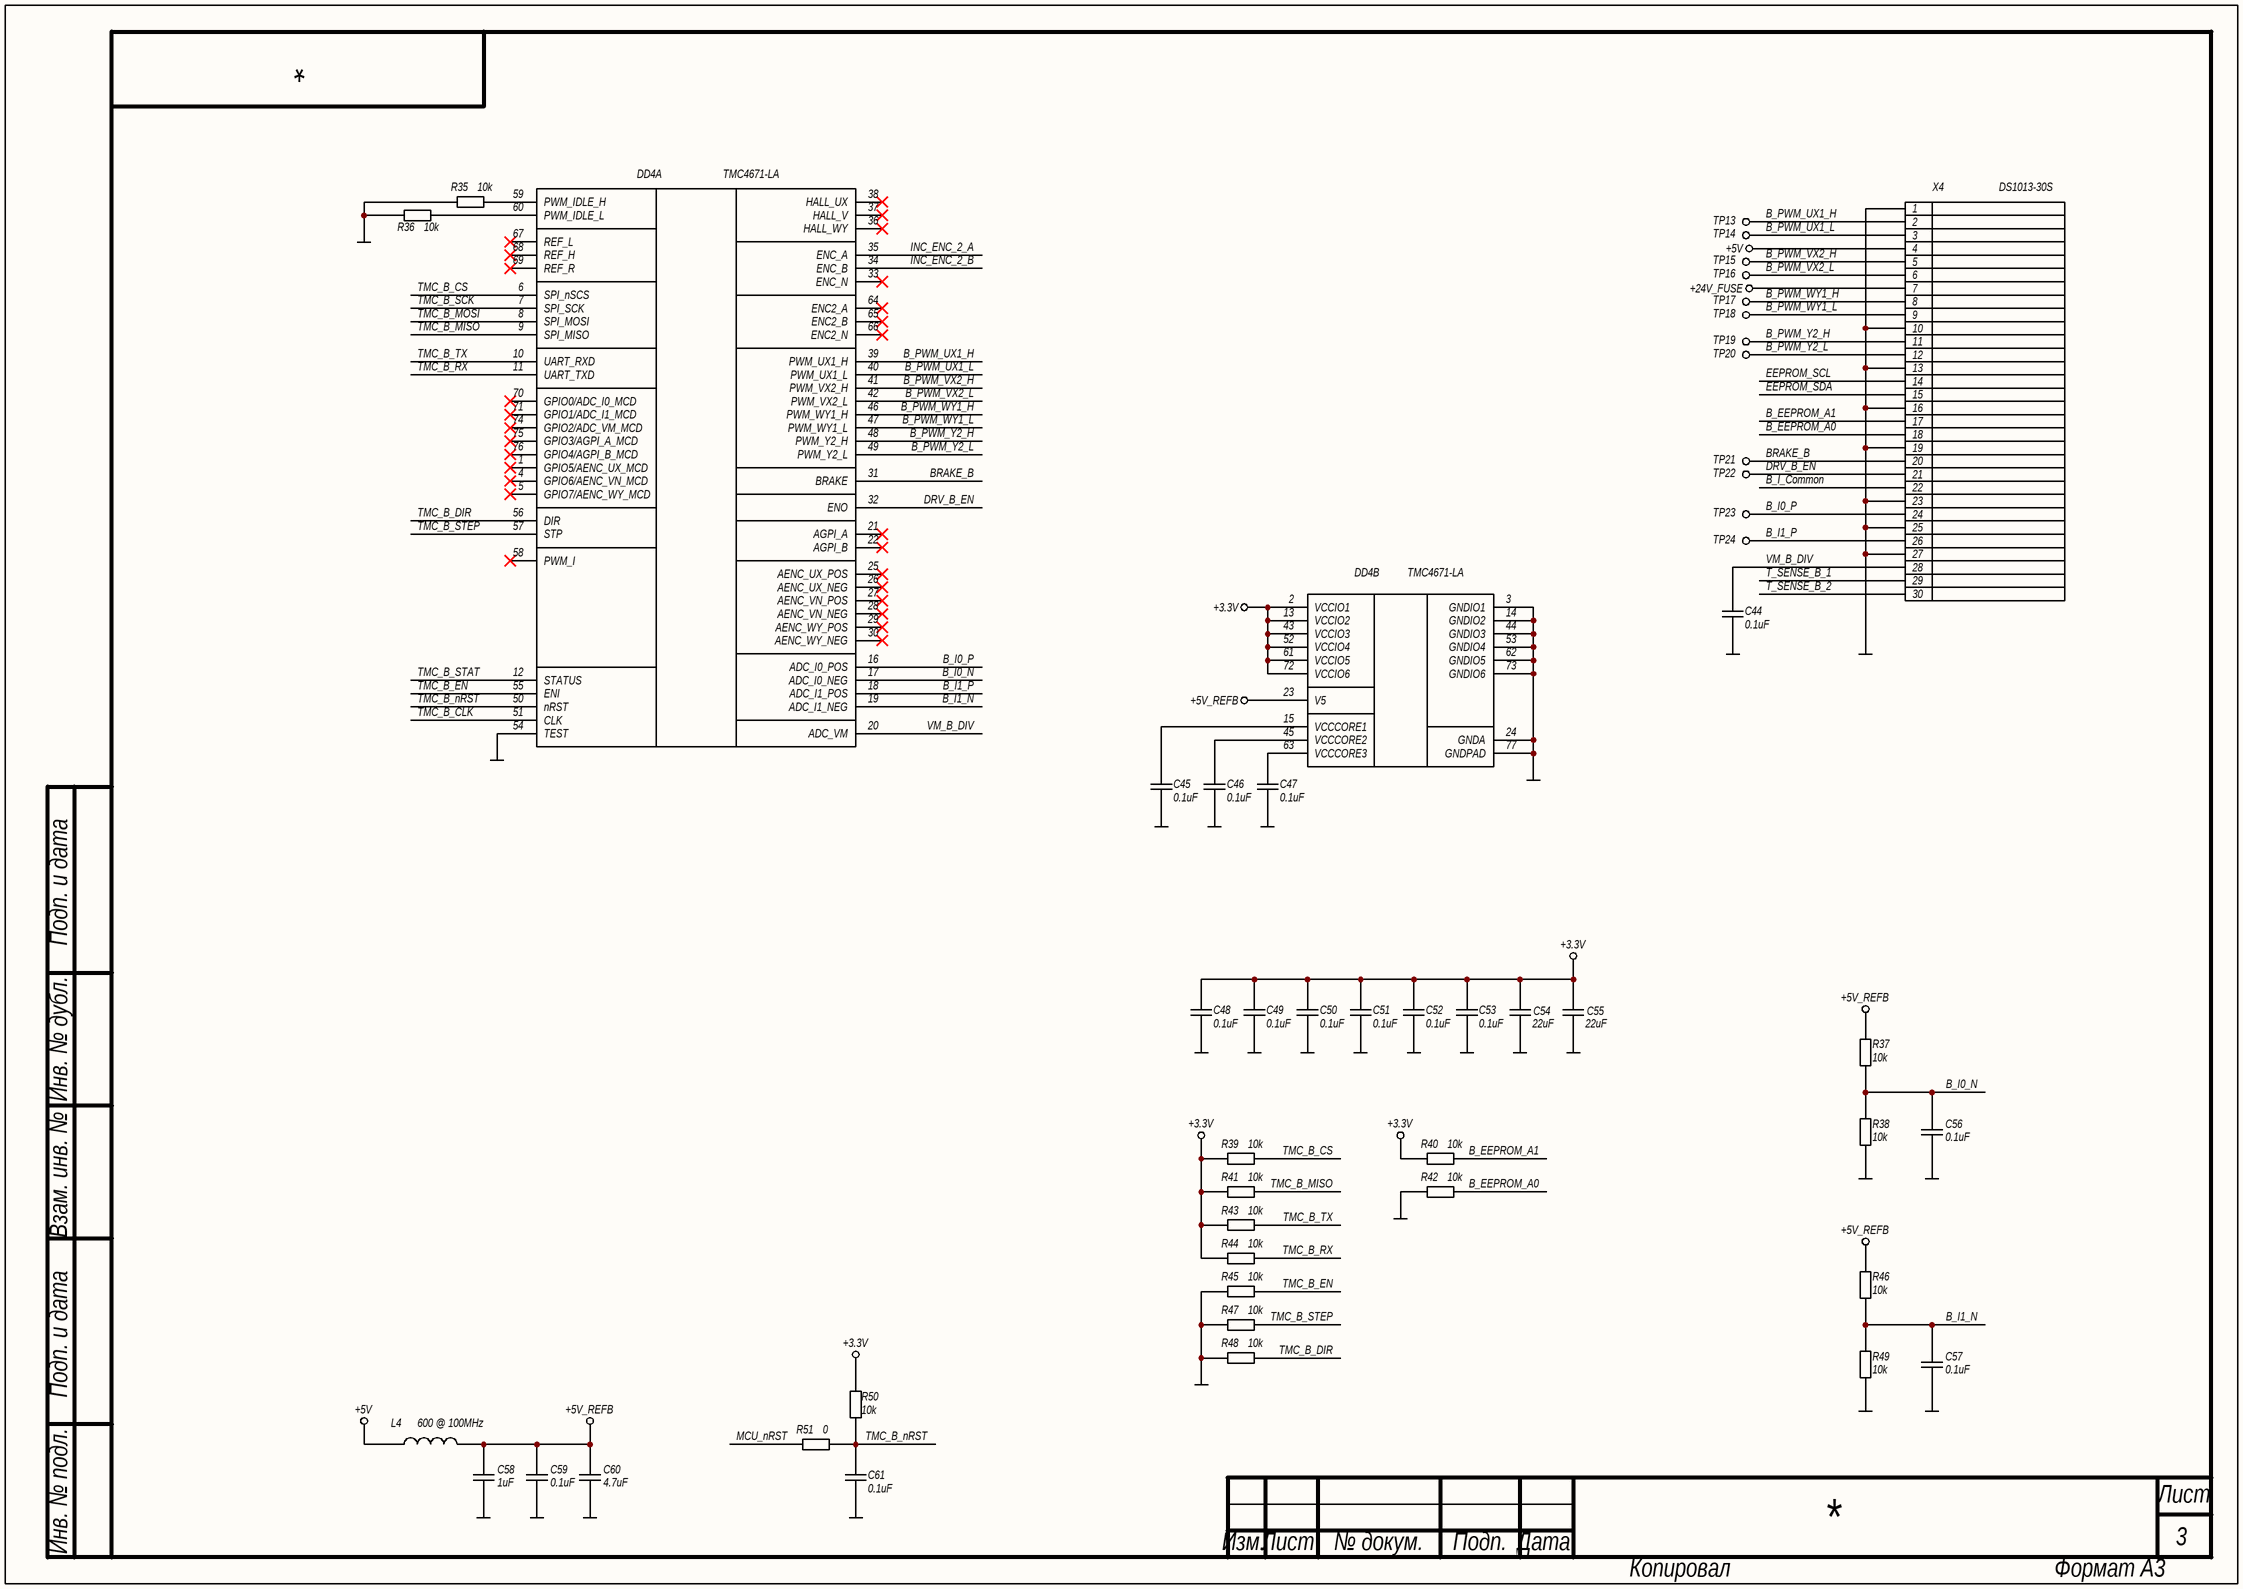
[diagram p2: DRIVER_B.SchDoc]

### Parts
C44  0.1uF  [C0603N]
C45  0.1uF  [C0603N]
C46  0.1uF  [C0603N]
C47  0.1uF  [C0603N]
C48  0.1uF  [C0603N]
C49  0.1uF  [C0603N]
C50  0.1uF  [C0603N]
C51  0.1uF  [C0603N]
C52  0.1uF  [C0603N]
C53  0.1uF  [C0603N]
C54  22uF  [C0805N]
C55  22uF  [C0805N]
C56  0.1uF  [C0603N]
C57  0.1uF  [C0603N]
C58  1uF  [C0603N]
C59  0.1uF  [C0603N]
C60  4.7uF  [C0603N]
C61  0.1uF  [C0603N]
DD4  TMC4671-LA  [QFN76-EP]  (parts A,B of 2)
L4  600 @ 100MHz  [FB0603N]
R35  10k  [R0603N]
R36  10k  [R0603N]
R37  10k  [R0603N]
R38  10k  [R0603N]
R39  10k  [R0603N]
R40  10k  [R0603N]
R41  10k  [R0603N]
R42  10k  [R0603N]
R43  10k  [R0603N]
R44  10k  [R0603N]
R45  10k  [R0603N]
R46  10k  [R0603N]
R47  10k  [R0603N]
R48  10k  [R0603N]
R49  10k  [R0603N]
R50  10k  [R0603N]
R51  0  [R0603N]
TP13  TEST_POINT  [TP_RPAD_0.8MM]  (value not drawn)  (no BOM)
TP14  TEST_POINT  [TP_RPAD_0.8MM]  (value not drawn)  (no BOM)
TP15  TEST_POINT  [TP_RPAD_0.8MM]  (value not drawn)  (no BOM)
TP16  TEST_POINT  [TP_RPAD_0.8MM]  (value not drawn)  (no BOM)
TP17  TEST_POINT  [TP_RPAD_0.8MM]  (value not drawn)  (no BOM)
TP18  TEST_POINT  [TP_RPAD_0.8MM]  (value not drawn)  (no BOM)
TP19  TEST_POINT  [TP_RPAD_0.8MM]  (value not drawn)  (no BOM)
TP20  TEST_POINT  [TP_RPAD_0.8MM]  (value not drawn)  (no BOM)
TP21  TEST_POINT  [TP_RPAD_0.8MM]  (value not drawn)  (no BOM)
TP22  TEST_POINT  [TP_RPAD_0.8MM]  (value not drawn)  (no BOM)
TP23  TEST_POINT  [TP_RPAD_0.8MM]  (value not drawn)  (no BOM)
TP24  TEST_POINT  [TP_RPAD_0.8MM]  (value not drawn)  (no BOM)
X4  DS1013-30S  [2.54_2X15_HEADER_BOX]

### Nets
+3.3V: C48.2 C49.2 C50.2 C51.2 C52.2 C53.2 C54.2 C55.2 DD4.2(VCCIO1) DD4.13(VCCIO2) DD4.43(VCCIO3) DD4.52(VCCIO4) DD4.61(VCCIO5) DD4.72(VCCIO6) R39.2 R40.2 R41.2 R43.2 R44.2 R50.2
+5V: L4.1 X4.4
+5V_REFB: C58.2 C59.2 C60.2 DD4.23(V5) L4.2 R37.2 R46.2
+24V_FUSE: X4.7
GND: C44.1 C45.1 C46.1 C47.1 C48.1 C49.1 C50.1 C51.1 C52.1 C53.1 C54.1 C55.1 C56.1 C57.1 C58.1 C59.1 C60.1 C61.1 DD4.3(GNDIO1) DD4.14(GNDIO2) DD4.24(GNDA) DD4.44(GNDIO3) DD4.53(GNDIO4) DD4.54(TEST) DD4.62(GNDIO5) DD4.73(GNDIO6) DD4.77(GNDPAD) R35.2 R36.2 R38.1 R42.2 R45.2 R47.2 R48.2 R49.1 X4.1 X4.10 X4.13 X4.16 X4.19 X4.23 X4.25 X4.27
B_EEPROM_A0: R42.1 X4.18
B_EEPROM_A1: R40.1 X4.17
B_I0_N: C56.2 DD4.17(ADC_I0_NEG) R37.1 R38.2
B_I0_P: DD4.16(ADC_I0_POS) TP23.1 X4.24
B_I1_N: C57.2 DD4.19(ADC_I1_NEG) R46.1 R49.2
B_I1_P: DD4.18(ADC_I1_POS) TP24.1 X4.26
B_I_Common: X4.22
B_PWM_UX1_H: DD4.39(PWM_UX1_H) TP13.1 X4.2
B_PWM_UX1_L: DD4.40(PWM_UX1_L) TP14.1 X4.3
B_PWM_VX2_H: DD4.41(PWM_VX2_H) TP15.1 X4.5
B_PWM_VX2_L: DD4.42(PWM_VX2_L) TP16.1 X4.6
B_PWM_WY1_H: DD4.46(PWM_WY1_H) TP17.1 X4.8
B_PWM_WY1_L: DD4.47(PWM_WY1_L) TP18.1 X4.9
B_PWM_Y2_H: DD4.48(PWM_Y2_H) TP19.1 X4.11
B_PWM_Y2_L: DD4.49(PWM_Y2_L) TP20.1 X4.12
BRAKE_B: DD4.31(BRAKE) TP21.1 X4.20
DRV_B_EN: DD4.32(ENO) TP22.1 X4.21
EEPROM_SCL: X4.14
EEPROM_SDA: X4.15
INC_ENC_2_A: DD4.35(ENC_A)
INC_ENC_2_B: DD4.34(ENC_B)
MCU_nRST: R51.2
T_SENSE_B_1: X4.29
T_SENSE_B_2: X4.30
TMC_B_CLK: DD4.51(CLK)
TMC_B_CS: DD4.6(SPI_nSCS) R39.1
TMC_B_DIR: DD4.56(DIR) R48.1
TMC_B_EN: DD4.55(ENI) R45.1
TMC_B_MISO: DD4.9(SPI_MISO) R41.1
TMC_B_MOSI: DD4.8(SPI_MOSI)
TMC_B_nRST: C61.2 DD4.50(nRST) R50.1 R51.1
TMC_B_RX: DD4.11(UART_TXD) R44.1
TMC_B_SCK: DD4.7(SPI_SCK)
TMC_B_STAT: DD4.12(STATUS)
TMC_B_STEP: DD4.57(STP) R47.1
TMC_B_TX: DD4.10(UART_RXD) R43.1
VM_B_DIV: C44.2 DD4.20(ADC_VM) X4.28
NetC45_2: C45.2 DD4.15(VCCCORE1)
NetC46_2: C46.2 DD4.45(VCCCORE2)
NetC47_2: C47.2 DD4.63(VCCCORE3)
NetDD4_59: DD4.59(PWM_IDLE_H) R35.1
NetDD4_60: DD4.60(PWM_IDLE_L) R36.1

Not connected (* = marked no-connect by the designer): DD4 1(GPIO5/AENC_UX_MCD)* 4(GPIO6/AENC_VN_MCD)* 5(GPIO7/AENC_WY_MCD)* 21(AGPI_A)* 22(AGPI_B)* 25(AENC_UX_POS)* 26(AENC_UX_NEG)* 27(AENC_VN_POS)* 28(AENC_VN_NEG)* 29(AENC_WY_POS)* 30(AENC_WY_NEG)* 33(ENC_N)* 36(HALL_WY)* 37(HALL_V)* 38(HALL_UX)* 58(PWM_I)* 64(ENC2_A)* 65(ENC2_B)* 66(ENC2_N)* 67(REF_L)* 68(REF_H)* 69(REF_R)* 70(GPIO0/ADC_I0_MCD)* 71(GPIO1/ADC_I1_MCD)* 74(GPIO2/ADC_VM_MCD)* 75(GPIO3/AGPI_A_MCD)* 76(GPIO4/AGPI_B_MCD)*

### Notes on the sheet
- Подп. и дата
- Инв. № дубл.
- Взам. инв. №
- Инв. № подл.
- Лист
- Изм.
- № докум.
- Подп.
- Дата
- Копировал
- Формат А3

### Library data of the parts
C44-C53 C56 C57 C59 C61 = CL10B104KB8NNNC: as C3 on sheet MCU; Артикул: CL10B104KB8NNNC; Номинал: 0.1uF; Строка для документации: https://mm.digikey.com/Volume0/opasdata/d220001/medias/docus/609/CL10B104KB8NNNC_Spec.pdf; Тип элемента: Конденсатор
C54 C55 = CL21A226MOCLRNC: as C36 on sheet DRIVER_A; Артикул: CL21A226MOCLRNC; Номинал: 22uF; Строка для документации: https://mm.digikey.com/Volume0/opasdata/d220001/medias/docus/43/CL21A226MOCLRNC_Spec.pdf; Тип элемента: Конденсатор
C58 = CL10B105KO8NNNC: as C40 on sheet DRIVER_A; Артикул: CL10B105KO8NNNC; Номинал: 1uF; Строка для документации: https://weblib.samsungsem.com/mlcc/mlcc-ec-data-sheet.do?partNumber=CL10B105KO8NNN; Тип элемента: Конденсатор
C60 = CL10A475KO8NNNC: as C11 on sheet MCU; Артикул: CL10A475KO8NNNC; Номинал: 4.7uF; Строка для документации: https://mm.digikey.com/Volume0/opasdata/d220001/medias/docus/2328/CL10A475KO8NNNC_Spec.pdf; Тип элемента: Конденсатор
DD4 = TMC4671-LA: as DD2 on sheet DRIVER_A; Артикул: TMC4671-LA; Строка для документации: https://www.analog.com/media/en/technical-documentation/data-sheets/TMC4671-LA_datasheet_Rev2.07.pdf; Тип элемента: Микросхема
L4 = BLM18AG601SN1D: as L1 on sheet MCU; Артикул: BLM18AG601SN1D; Номинал: 600 @ 100MHz; Строка для документации: https://www.murata.com/en-us/products/productdata/8796738650142/ENFA0003.pdf; Тип элемента: Фильтр ЭМП
R35-R50 = RC0603FR-0710KL: as R4 on sheet MCU; Артикул: RC0603FR-0710KL; Номинал: 10k; Строка для документации: https://www.yageo.com/upload/media/product/app/datasheet/rchip/pyu-rc_group_51_rohs_l.pdf; Тип элемента: Резистор
R51 = RC0603FR-070RL: as R12 on sheet MCU; Артикул: RC0603FR-070RL; Номинал: 0; Строка для документации: https://www.yageo.com/upload/media/product/app/datasheet/rchip/pyu-rc_group_51_rohs_l.pdf; Тип элемента: Резистор
TP13-TP24 = Test Point, Round Pad, 0.8mm diameter: as TP1 on sheet DRIVER_A; Артикул: Test Point, Round Pad, 0.8mm diameter; Тип разъема: Test Point; Описание: Test Point, Round Pad, 0.8mm diameter
X4 = DS1013-30S: as X3 on sheet DRIVER_A; Артикул: DS1013-30S; Строка для документации: http://cn.connfly.group/static/upload/file/pdf/DS1013.pdf; Тип элемента: Разъем

## Sheet ABS_ENC_IF.SchDoc
size 420 x 297 mm; SheetNumber: 4; PageSetup: Record=PageOptions|CenterHorizontal=False|CenterVertical=False|PrintScale=0.95|XCorrection=0.00|YCorrection=0.00|PrintKind=1|BorderSize=5000000|LeftOffset=0|BottomOffset=0|Orientation=1|PaperLength=1000|PaperWidth=1000|Scale=100|PaperSource=15|PrintQuality=600|MediaType=1|DitherType=10|PaperKind=A4|PrintScaleMode=1
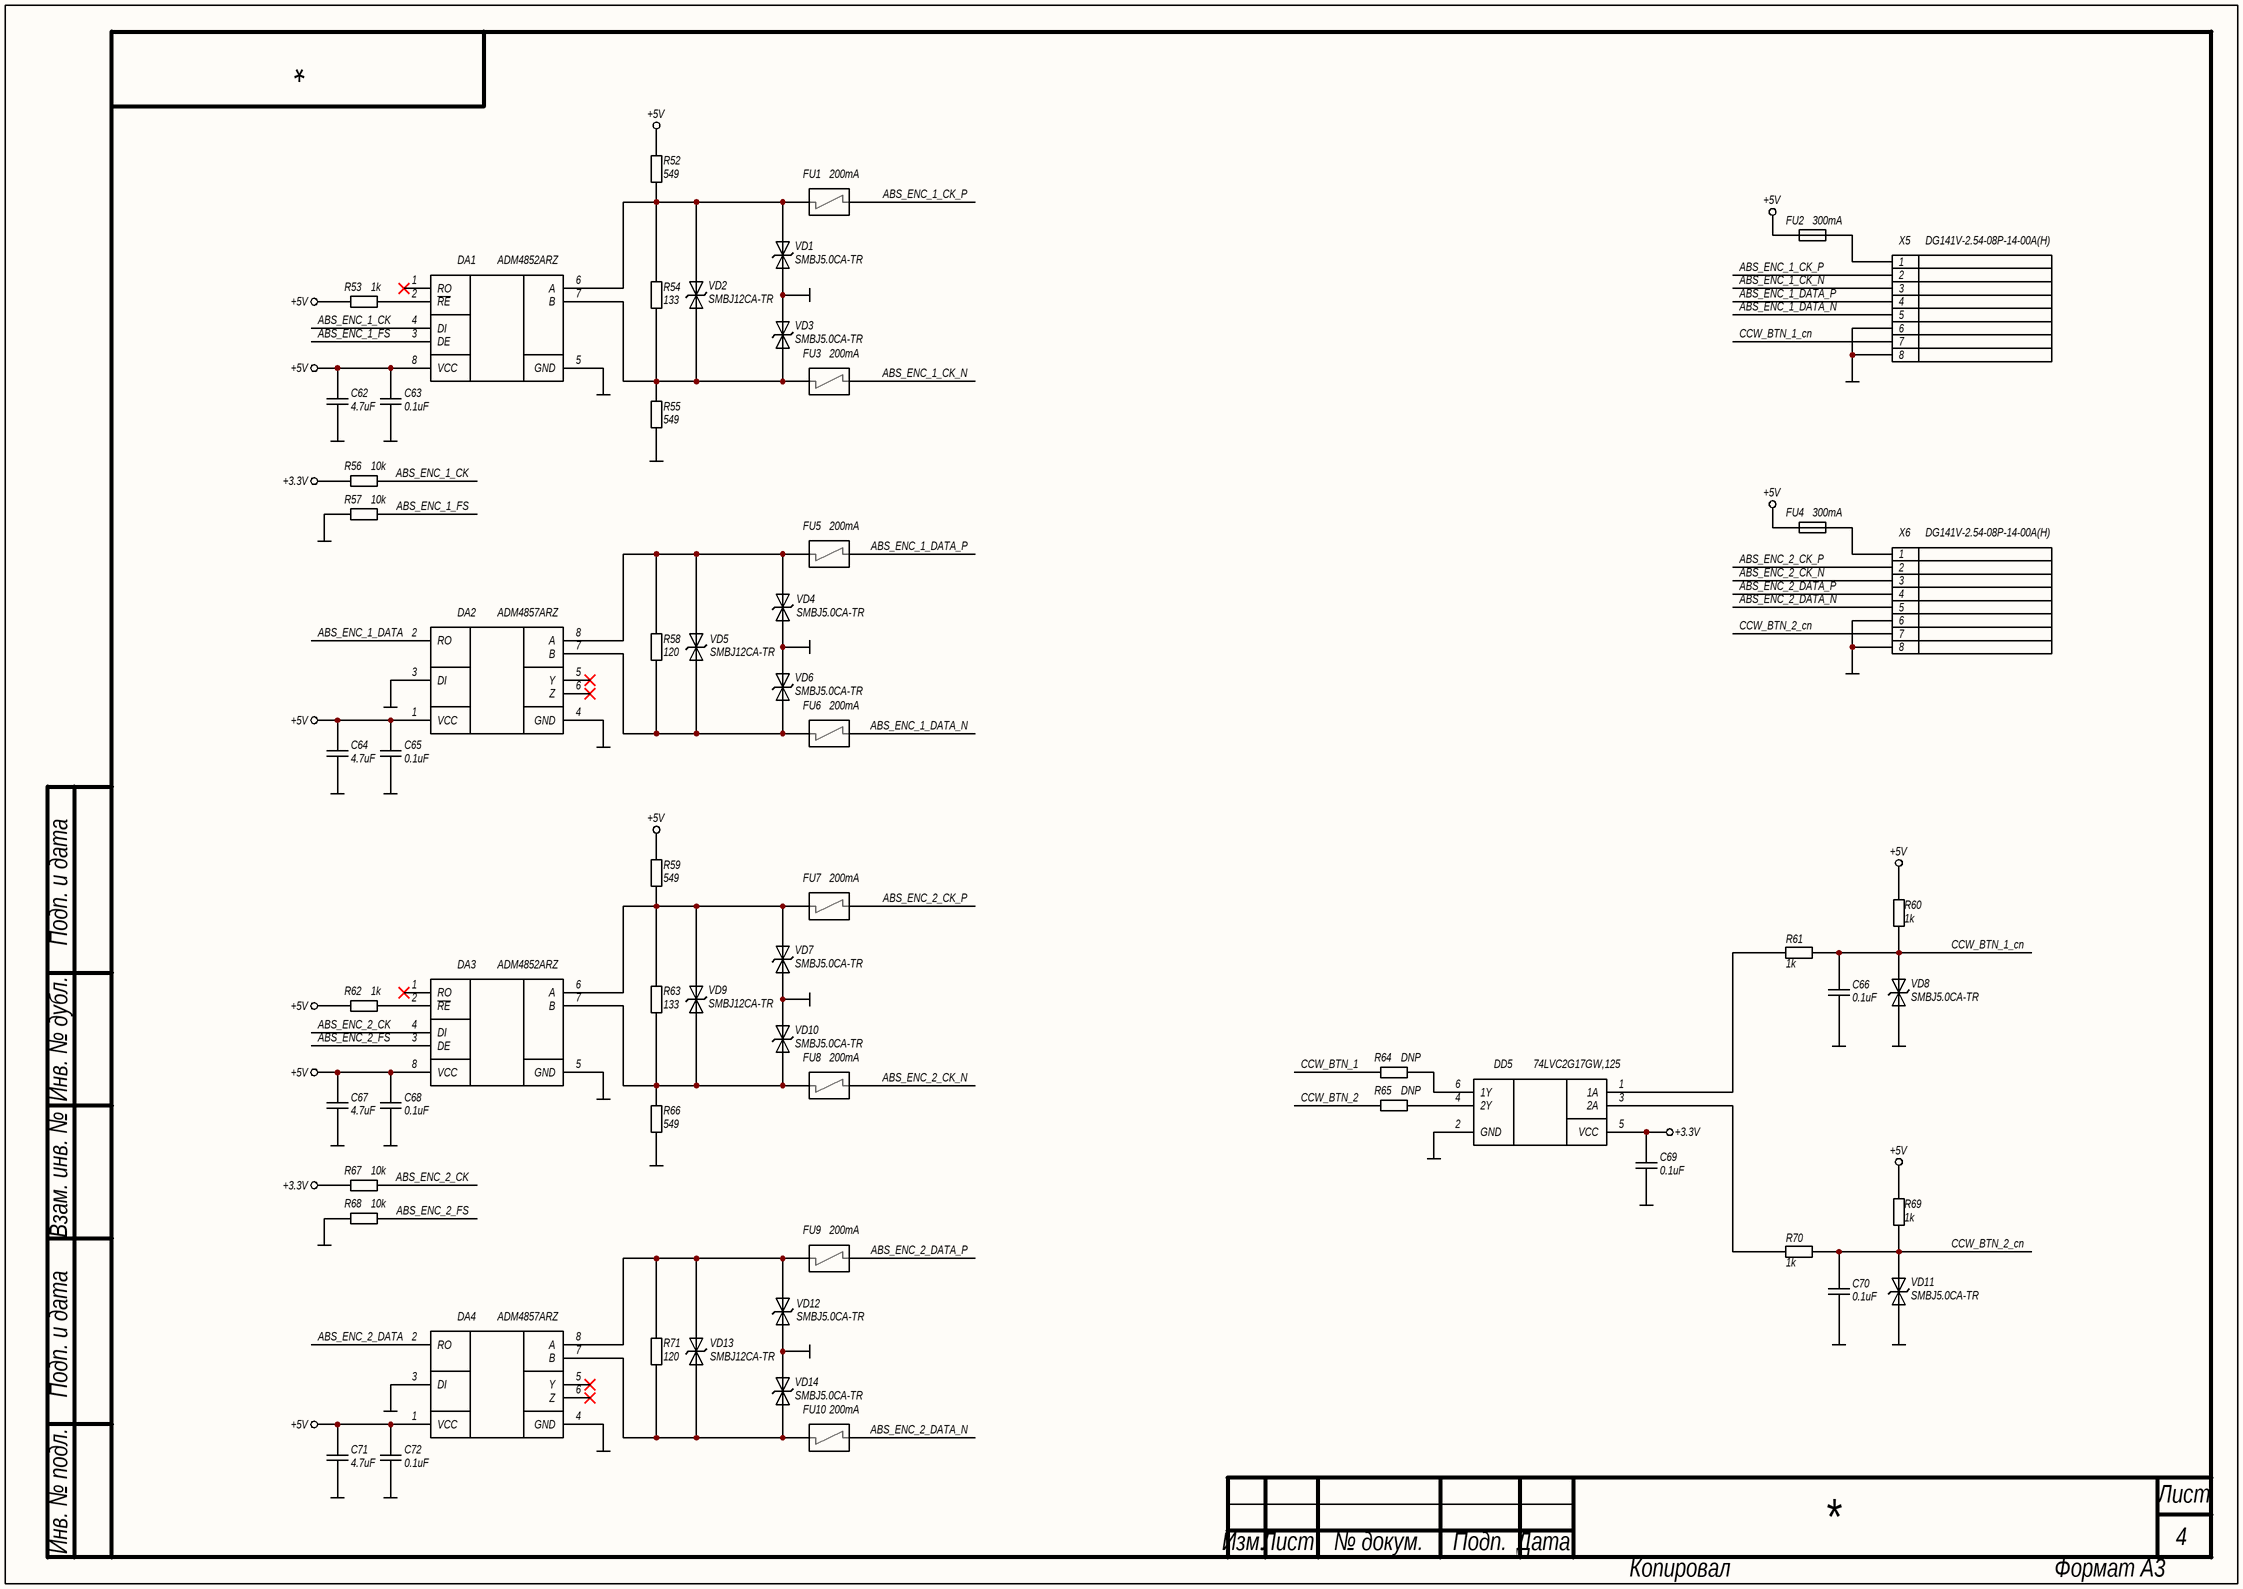
[diagram p3: ABS_ENC_IF.SchDoc]

### Parts
C62  4.7uF  [C0603N]
C63  0.1uF  [C0603N]
C64  4.7uF  [C0603N]
C65  0.1uF  [C0603N]
C66  0.1uF  [C0603N]
C67  4.7uF  [C0603N]
C68  0.1uF  [C0603N]
C69  0.1uF  [C0603N]
C70  0.1uF  [C0603N]
C71  4.7uF  [C0603N]
C72  0.1uF  [C0603N]
DA1  ADM4852ARZ  [SOIC8]
DA2  ADM4857ARZ  [SOIC8]
DA3  ADM4852ARZ  [SOIC8]
DA4  ADM4857ARZ  [SOIC8]
DD5  74LVC2G17GW,125  [SOT363-2]
FU1  200mA  [TBU-CA]
FU2  300mA  [MF-MSMF]
FU3  200mA  [TBU-CA]
FU4  300mA  [MF-MSMF]
FU5  200mA  [TBU-CA]
FU6  200mA  [TBU-CA]
FU7  200mA  [TBU-CA]
FU8  200mA  [TBU-CA]
FU9  200mA  [TBU-CA]
FU10  200mA  [TBU-CA]
R52  549  [R0805N]
R53  1k  [R0603N]
R54  133  [R0805N]
R55  549  [R0805N]
R56  10k  [R0603N]
R57  10k  [R0603N]
R58  120  [R0805N]
R59  549  [R0805N]
R60  1k  [R0603N]
R61  1k  [R0603N]
R62  1k  [R0603N]
R63  133  [R0805N]
R64  DNP  [R0603N]  (no BOM)
R65  DNP  [R0603N]  (no BOM)
R66  549  [R0805N]
R67  10k  [R0603N]
R68  10k  [R0603N]
R69  1k  [R0603N]
R70  1k  [R0603N]
R71  120  [R0805N]
VD1  SMBJ5.0CA-TR  [SMB]
VD2  SMBJ12CA-TR  [SMB]
VD3  SMBJ5.0CA-TR  [SMB]
VD4  SMBJ5.0CA-TR  [SMB]
VD5  SMBJ12CA-TR  [SMB]
VD6  SMBJ5.0CA-TR  [SMB]
VD7  SMBJ5.0CA-TR  [SMB]
VD8  SMBJ5.0CA-TR  [SMB]
VD9  SMBJ12CA-TR  [SMB]
VD10  SMBJ5.0CA-TR  [SMB]
VD11  SMBJ5.0CA-TR  [SMB]
VD12  SMBJ5.0CA-TR  [SMB]
VD13  SMBJ12CA-TR  [SMB]
VD14  SMBJ5.0CA-TR  [SMB]
X5  DG141V-2.54-08P-14-00A(H)  [DG141V-2.54-08P-14-00A(H)]
X6  DG141V-2.54-08P-14-00A(H)  [DG141V-2.54-08P-14-00A(H)]

### Nets
+3.3V: C69.2 DD5.5(VCC) R56.2 R67.2
+5V: C62.2 C63.2 C64.2 C65.2 C67.2 C68.2 C71.2 C72.2 DA1.8(VCC) DA2.1(VCC) DA3.8(VCC) DA4.1(VCC) FU2.1 FU4.1 R52.2 R53.2 R59.2 R60.1 R62.2 R69.1
GND: C62.1 C63.1 C64.1 C65.1 C66.1 C67.1 C68.1 C69.1 C70.1 C71.1 C72.1 DA1.5(GND) DA2.3(DI) DA2.4(GND) DA3.5(GND) DA4.3(DI) DA4.4(GND) DD5.2(GND) R55.1 R57.2 R66.1 R68.2 VD1.2(A2) VD3.2(A2) VD4.2(A2) VD6.2(A2) VD7.2(A2) VD8.2(A2) VD10.2(A2) VD11.2(A2) VD12.2(A2) VD14.2(A2) X5.6 X5.8 X6.6 X6.8
ABS_ENC_1_CK: DA1.4(DI) R56.1
ABS_ENC_1_CK_N: FU3.3(IN/OUT) X5.3
ABS_ENC_1_CK_P: FU1.3(IN/OUT) X5.2
ABS_ENC_1_DATA: DA2.2(RO)
ABS_ENC_1_DATA_N: FU6.3(IN/OUT) X5.5
ABS_ENC_1_DATA_P: FU5.3(IN/OUT) X5.4
ABS_ENC_1_FS: DA1.3(DE) R57.1
ABS_ENC_2_CK: DA3.4(DI) R67.1
ABS_ENC_2_CK_N: FU8.3(IN/OUT) X6.3
ABS_ENC_2_CK_P: FU7.3(IN/OUT) X6.2
ABS_ENC_2_DATA: DA4.2(RO)
ABS_ENC_2_DATA_N: FU10.3(IN/OUT) X6.5
ABS_ENC_2_DATA_P: FU9.3(IN/OUT) X6.4
ABS_ENC_2_FS: DA3.3(DE) R68.1
CCW_BTN_1: R64.2
CCW_BTN_1_cn: C66.2 R60.2 R61.2 VD8.1(A1) X5.7
CCW_BTN_2: R65.2
CCW_BTN_2_cn: C70.2 R69.2 R70.2 VD11.1(A1) X6.7
NetDA1_2: DA1.2(~{RE}) R53.1
NetDA1_6: DA1.6(A) FU1.1(IN/OUT) R52.1 R54.2 VD1.1(A1) VD2.1(A1)
NetDA1_7: DA1.7(B) FU3.1(IN/OUT) R54.1 R55.2 VD2.2(A2) VD3.1(A1)
NetDA2_7: DA2.7(B) FU6.1(IN/OUT) R58.2 VD5.2(A2) VD6.1(A1)
NetDA2_8: DA2.8(A) FU5.1(IN/OUT) R58.1 VD4.1(A1) VD5.1(A1)
NetDA3_2: DA3.2(~{RE}) R62.1
NetDA3_6: DA3.6(A) FU7.1(IN/OUT) R59.1 R63.2 VD7.1(A1) VD9.1(A1)
NetDA3_7: DA3.7(B) FU8.1(IN/OUT) R63.1 R66.2 VD9.2(A2) VD10.1(A1)
NetDA4_7: DA4.7(B) FU10.1(IN/OUT) R71.2 VD13.2(A2) VD14.1(A1)
NetDA4_8: DA4.8(A) FU9.1(IN/OUT) R71.1 VD12.1(A1) VD13.1(A1)
NetDD5_1: DD5.1(1A) R61.1
NetDD5_3: DD5.3(2A) R70.1
NetDD5_4: DD5.4(2Y) R65.1
NetDD5_6: DD5.6(1Y) R64.1
NetFU2_2: FU2.2 X5.1
NetFU4_2: FU4.2 X6.1

Not connected (* = marked no-connect by the designer): DA1 1(RO)*; DA2 5(Y)* 6(Z)*; DA3 1(RO)*; DA4 5(Y)* 6(Z)*

### Notes on the sheet
- Подп. и дата
- Инв. № дубл.
- Взам. инв. №
- Инв. № подл.
- Лист
- Изм.
- № докум.
- Подп.
- Дата
- Копировал
- Формат А3

### Library data of the parts
C62 C64 C67 C71 = CL10A475KO8NNNC: as C11 on sheet MCU; Артикул: CL10A475KO8NNNC; Номинал: 4.7uF; Строка для документации: https://mm.digikey.com/Volume0/opasdata/d220001/medias/docus/2328/CL10A475KO8NNNC_Spec.pdf; Тип элемента: Конденсатор
C63 C65 C66 C68-C70 C72 = CL10B104KB8NNNC: as C3 on sheet MCU; Артикул: CL10B104KB8NNNC; Номинал: 0.1uF; Строка для документации: https://mm.digikey.com/Volume0/opasdata/d220001/medias/docus/609/CL10B104KB8NNNC_Spec.pdf; Тип элемента: Конденсатор
DA1 DA3 = ADM4852ARZ: Микросхема интерфейса RS485; Производитель: "D:\Altium\Libraries\GOST_LIBS\Libraries\IC\Analog Devices\ADM4852A.SchLib"; Описание: 1/1 Transceiver Half RS422, RS485 8-SOIC; Корпус: 8-SOIC (0.154", 3.90mm Width); Температурный диапазон: -40°C ~ 85°C; Вид монтажа: SMD; Артикул: ADM4852ARZ; Строка для документации: https://www.analog.com/media/en/technical-documentation/data-sheets/ADM4850_4851_4852_4853_4854_4855_4856_4857.pdf; Тип элемента: Микросхема
DA2 DA4 = ADM4857ARZ: Микросхема интерфейса RS485; Производитель: "D:\Altium\Libraries\GOST_LIBS\Libraries\IC\Analog Devices\ADM4852A.SchLib"; Описание: 1/1 Transceiver Full RS422, RS485 8-SOIC; Корпус: 8-SOIC (0.154", 3.90mm Width); Температурный диапазон: -40°C ~ 85°C; Вид монтажа: SMD; Артикул: ADM4857ARZ; Строка для документации: https://www.analog.com/media/en/technical-documentation/data-sheets/ADM4850_4851_4852_4853_4854_4855_4856_4857.pdf; Тип элемента: Микросхема
DD5 = 74LVC2G17GW,125: Микросхема сдвоенный триггер Шмитта; Производитель: Nexperia USA Inc.; Описание: Buffer, Non-Inverting 2 Element 1 Bit per Element Push-Pull Output 6-TSSOP; Корпус: 6-TSSOP; Температурный диапазон: -40°C ~ 125°C (TA); Вид монтажа: SMD; Артикул: 74LVC2G17GW,125; Строка для документации: https://assets.nexperia.com/documents/data-sheet/74LVC2G17.pdf; Тип элемента: Микросхема
FU1 FU3 FU5-FU10 = TBU-CA065-200-WH: Полупроводниковый предохранитель; Напряжение: 650V; Тип: Surge Suppression IС; Производитель: Bourns Inc.; Описание: SURGE SUPP TBU 200MA 650VIMP SMD; Корпус: 6.50mm x 4.00mm; Температурный диапазон: -55°C ~ 125°C; Вид монтажа: SMD; Артикул: TBU-CA065-200-WH; Ток: 200mA; Строка для документации: https://www.bourns.com/docs/Product-Datasheets/TBU-CA.pdf; Тип элемента: Предохранитель
FU2 FU4 = MF-MSMF030-2: Плавкий предохранитель; Напряжение: 30V; Тип: PTC Resettable Fuse; Производитель: Bourns Inc.; Описание: Polymeric PTC Resettable Fuse 30V 300 mA Ih Surface Mount 1812 (4532 Metric), Concave; Корпус: 1812 (4532 Metric), Concave; Температурный диапазон: -40°C ~ 85°C; Вид монтажа: SMD; Артикул: MF-MSMF030-2; Ток: 300mA; Строка для документации: https://www.bourns.com/docs/product-datasheets/mf-msmf.pdf; Тип элемента: Предохранитель
R52 R55 R59 R66 = RC0805FR-07549RL: Резистор; Точность: 1%; ТКС: ±100ppm/°C; Напряжение: 150V; Производитель: YAGEO; Описание: 549 Ohms ±1% 0.125W, 1/8W Chip Resistor 0805 (2012 Metric) Moisture Resistant Thick Film; Корпус: 0805 (2012 Metric); Температурный диапазон: -55°C ~ 155°C; Вид монтажа: SMD; Артикул: RC0805FR-07549RL; Номинал: 549; Строка для документации: https://www.yageo.com/upload/media/product/productsearch/datasheet/rchip/PYu-RC_Group_51_RoHS_L_12.pdf; Тип элемента: Резистор
R53 R60-R62 R69 R70 = RC0603FR-071KL: as R1 on sheet MCU; Артикул: RC0603FR-071KL; Номинал: 1k; Строка для документации: https://www.yageo.com/upload/media/product/app/datasheet/rchip/pyu-rc_group_51_rohs_l.pdf; Тип элемента: Резистор
R54 R63 = RC0805FR-07133RL: Резистор; Точность: 1%; ТКС: ±100ppm/°C; Напряжение: 150V; Производитель: YAGEO; Описание: 133 Ohms ±1% 0.125W, 1/8W Chip Resistor 0805 (2012 Metric) Moisture Resistant Thick Film; Корпус: 0805 (2012 Metric); Температурный диапазон: -55°C ~ 155°C; Вид монтажа: SMD; Артикул: RC0805FR-07133RL; Номинал: 133; Строка для документации: https://www.yageo.com/upload/media/product/productsearch/datasheet/rchip/PYu-RC_Group_51_RoHS_L_12.pdf; Тип элемента: Резистор
R56 R57 R67 R68 = RC0603FR-0710KL: as R4 on sheet MCU; Артикул: RC0603FR-0710KL; Номинал: 10k; Строка для документации: https://www.yageo.com/upload/media/product/app/datasheet/rchip/pyu-rc_group_51_rohs_l.pdf; Тип элемента: Резистор
R58 R71 = RC0805FR-07120RL: Резистор; Точность: 1%; ТКС: ±100ppm/°C; Напряжение: 150V; Производитель: YAGEO; Описание: 120 Ohms ±1% 0.125W, 1/8W Chip Resistor 0805 (2012 Metric) Moisture Resistant Thick Film; Корпус: 0805 (2012 Metric); Температурный диапазон: -55°C ~ 155°C; Вид монтажа: SMD; Артикул: RC0805FR-07120RL; Номинал: 120; Строка для документации: https://www.yageo.com/upload/media/product/productsearch/datasheet/rchip/PYu-RC_Group_51_RoHS_L_12.pdf; Тип элемента: Резистор
R64 R65 = RC0603FR-0733RL: as R18 on sheet DRIVER_A; Артикул: RC0603FR-0733RL; Номинал: DNP; Строка для документации: https://www.yageo.com/upload/media/product/app/datasheet/rchip/pyu-rc_group_51_rohs_l.pdf; Тип элемента: Резистор
VD1 VD3 VD4 VD6-VD8 VD10-VD12 VD14 = SMBJ5.0CA-TR: TVS диод двунаправленный; Напряжение: 5V; Напряжение ограничения: 9.2V; Напряжение пробоя: 6.4V; Ток: 68A; Тип: TVS Bidirectional; Производитель: STMicroelectronics; Описание: 9.2V Clamp 68A Ipp Tvs Diode Surface Mount SMB (DO-214AA); Корпус: DO-214AA, SMB; Температурный диапазон: -55°C ~ 150°C (TJ); Вид монтажа: SMD; Тип элемента: Диод защитный; Артикул: SMBJ5.0CA-TR; Строка для документации: https://www.st.com/content/ccc/resource/technical/document/datasheet/19/78/91/39/07/cd/40/65/CD00001366.pdf/files/CD00001366.pdf/_jcr_content/translations/en.CD00001366.pdf
VD2 VD5 VD9 VD13 = SMBJ12CA-TR: TVS диод двунаправленный; Напряжение: 12V; Напряжение ограничения: 19.9V; Напряжение пробоя: 13.3V; Ток: 31A; Тип: TVS Bidirectional; Производитель: STMicroelectronics; Описание: 19.9V Clamp 31A Ipp Tvs Diode Surface Mount SMB (DO-214AA); Корпус: DO-214AA, SMB; Температурный диапазон: -55°C ~ 150°C (TJ); Вид монтажа: SMD; Тип элемента: Диод защитный; Артикул: SMBJ12CA-TR; Строка для документации: https://www.st.com/content/ccc/resource/technical/document/datasheet/19/78/91/39/07/cd/40/65/CD00001366.pdf/files/CD00001366.pdf/_jcr_content/translations/en.CD00001366.pdf
X5 X6 = DG141V-2.54-08P-14-00A(H): Разъем, 8 контактов; Тип разъема: Push-Button terminal block; Количество контактов: 8; Шаг контактов: 2.54mm; Ток: 2A; Напряжение: 150V; Производитель: Degson Electronics; Описание: 8 Position Wire to Board Terminal Block Vertical with Board 0.100" (2.54mm) Through Hole; Температурный диапазон: -40°C ~ 105°C; Вид монтажа: Through Hole; Артикул: DG141V-2.54-08P-14-00A(H); Строка для документации: https://static.chipdip.ru/lib/874/DOC000874680.pdf; Тип элемента: Разъем

## Sheet INC_ENC_IF.SchDoc
size 420 x 297 mm; SheetNumber: 5; PageSetup: Record=PageOptions|CenterHorizontal=False|CenterVertical=False|PrintScale=0.95|XCorrection=0.00|YCorrection=0.00|PrintKind=1|BorderSize=5000000|LeftOffset=0|BottomOffset=0|Orientation=1|PaperLength=1000|PaperWidth=1000|Scale=100|PaperSource=15|PrintQuality=600|MediaType=1|DitherType=10|PaperKind=A4|PrintScaleMode=1
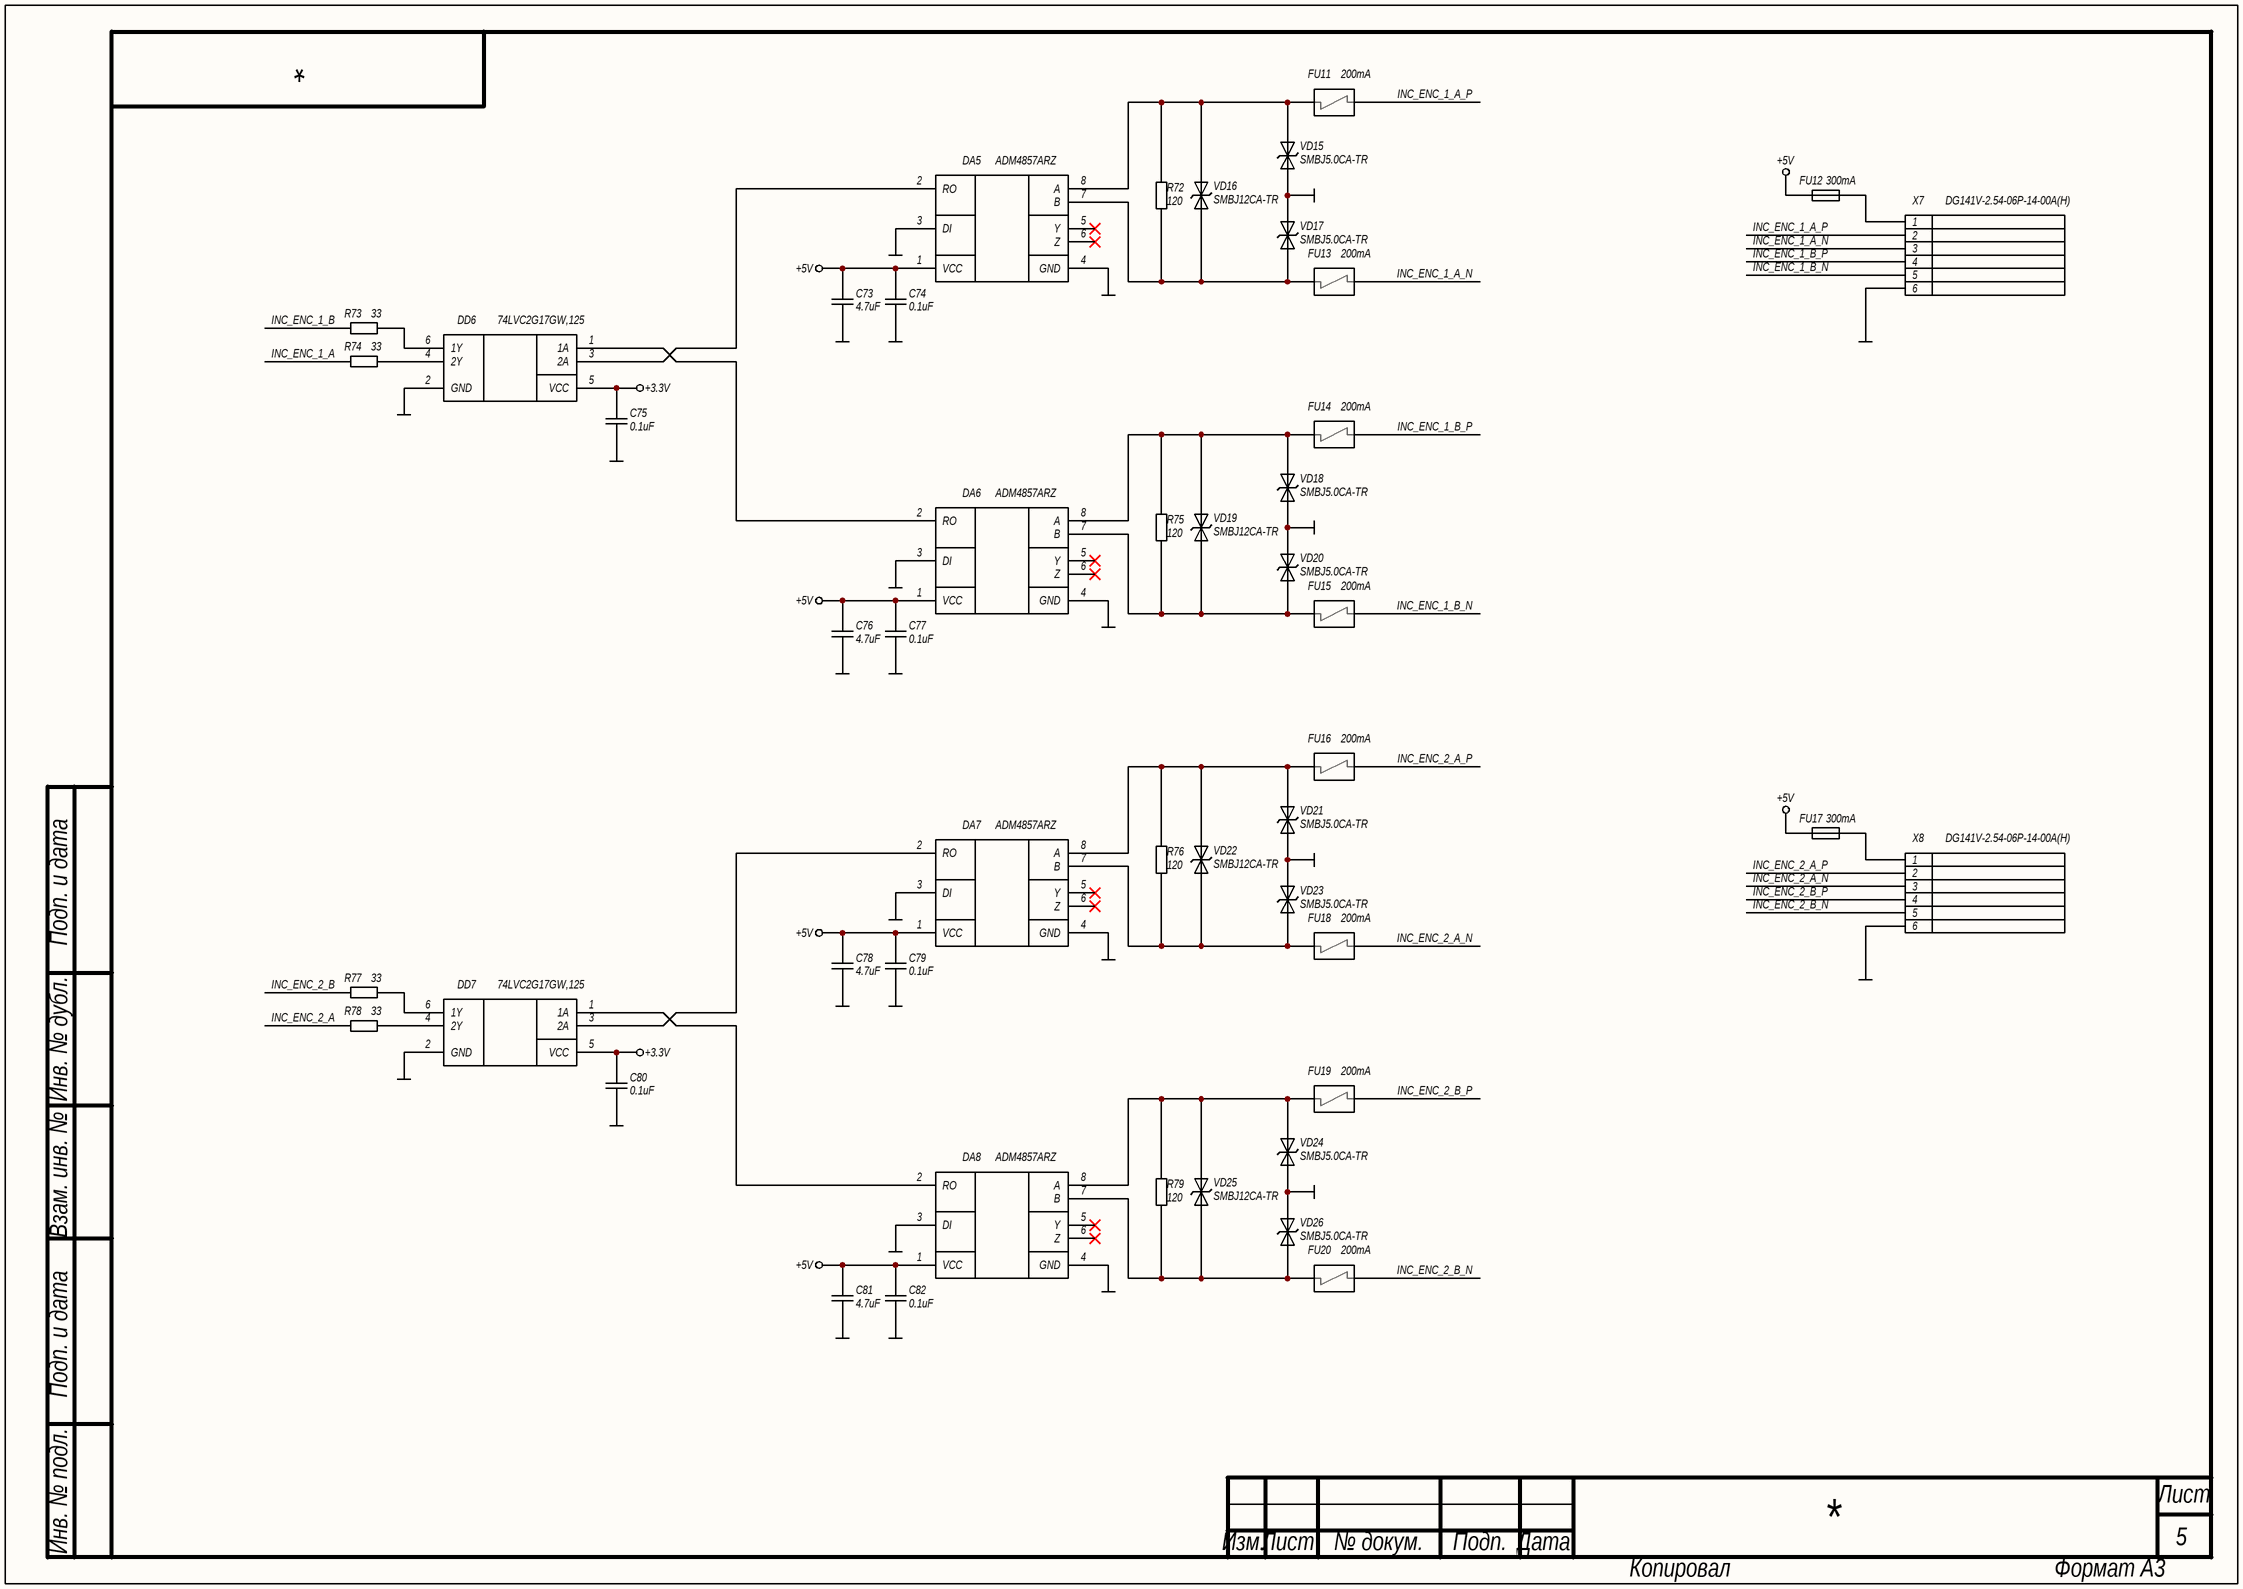
[diagram p4: INC_ENC_IF.SchDoc]

### Parts
C73  4.7uF  [C0603N]
C74  0.1uF  [C0603N]
C75  0.1uF  [C0603N]
C76  4.7uF  [C0603N]
C77  0.1uF  [C0603N]
C78  4.7uF  [C0603N]
C79  0.1uF  [C0603N]
C80  0.1uF  [C0603N]
C81  4.7uF  [C0603N]
C82  0.1uF  [C0603N]
DA5  ADM4857ARZ  [SOIC8]
DA6  ADM4857ARZ  [SOIC8]
DA7  ADM4857ARZ  [SOIC8]
DA8  ADM4857ARZ  [SOIC8]
DD6  74LVC2G17GW,125  [SOT363-2]
DD7  74LVC2G17GW,125  [SOT363-2]
FU11  200mA  [TBU-CA]
FU12  300mA  [MF-MSMF]
FU13  200mA  [TBU-CA]
FU14  200mA  [TBU-CA]
FU15  200mA  [TBU-CA]
FU16  200mA  [TBU-CA]
FU17  300mA  [MF-MSMF]
FU18  200mA  [TBU-CA]
FU19  200mA  [TBU-CA]
FU20  200mA  [TBU-CA]
R72  120  [R0805N]
R73  33  [R0603N]
R74  33  [R0603N]
R75  120  [R0805N]
R76  120  [R0805N]
R77  33  [R0603N]
R78  33  [R0603N]
R79  120  [R0805N]
VD15  SMBJ5.0CA-TR  [SMB]
VD16  SMBJ12CA-TR  [SMB]
VD17  SMBJ5.0CA-TR  [SMB]
VD18  SMBJ5.0CA-TR  [SMB]
VD19  SMBJ12CA-TR  [SMB]
VD20  SMBJ5.0CA-TR  [SMB]
VD21  SMBJ5.0CA-TR  [SMB]
VD22  SMBJ12CA-TR  [SMB]
VD23  SMBJ5.0CA-TR  [SMB]
VD24  SMBJ5.0CA-TR  [SMB]
VD25  SMBJ12CA-TR  [SMB]
VD26  SMBJ5.0CA-TR  [SMB]
X7  DG141V-2.54-06P-14-00A(H)  [DG141V-2.54-06P-14-00A(H)]
X8  DG141V-2.54-06P-14-00A(H)  [DG141V-2.54-06P-14-00A(H)]

### Nets
+3.3V: C75.2 C80.2 DD6.5(VCC) DD7.5(VCC)
+5V: C73.2 C74.2 C76.2 C77.2 C78.2 C79.2 C81.2 C82.2 DA5.1(VCC) DA6.1(VCC) DA7.1(VCC) DA8.1(VCC) FU12.1 FU17.1
GND: C73.1 C74.1 C75.1 C76.1 C77.1 C78.1 C79.1 C80.1 C81.1 C82.1 DA5.3(DI) DA5.4(GND) DA6.3(DI) DA6.4(GND) DA7.3(DI) DA7.4(GND) DA8.3(DI) DA8.4(GND) DD6.2(GND) DD7.2(GND) VD15.2(A2) VD17.2(A2) VD18.2(A2) VD20.2(A2) VD21.2(A2) VD23.2(A2) VD24.2(A2) VD26.2(A2) X7.6 X8.6
INC_ENC_1_A: R74.2
INC_ENC_1_A_N: FU13.3(IN/OUT) X7.3
INC_ENC_1_A_P: FU11.3(IN/OUT) X7.2
INC_ENC_1_B: R73.2
INC_ENC_1_B_N: FU15.3(IN/OUT) X7.5
INC_ENC_1_B_P: FU14.3(IN/OUT) X7.4
INC_ENC_2_A: R78.2
INC_ENC_2_A_N: FU18.3(IN/OUT) X8.3
INC_ENC_2_A_P: FU16.3(IN/OUT) X8.2
INC_ENC_2_B: R77.2
INC_ENC_2_B_N: FU20.3(IN/OUT) X8.5
INC_ENC_2_B_P: FU19.3(IN/OUT) X8.4
NetDA5_2: DA5.2(RO) DD6.3(2A)
NetDA5_7: DA5.7(B) FU13.1(IN/OUT) R72.2 VD16.2(A2) VD17.1(A1)
NetDA5_8: DA5.8(A) FU11.1(IN/OUT) R72.1 VD15.1(A1) VD16.1(A1)
NetDA6_2: DA6.2(RO) DD6.1(1A)
NetDA6_7: DA6.7(B) FU15.1(IN/OUT) R75.2 VD19.2(A2) VD20.1(A1)
NetDA6_8: DA6.8(A) FU14.1(IN/OUT) R75.1 VD18.1(A1) VD19.1(A1)
NetDA7_2: DA7.2(RO) DD7.3(2A)
NetDA7_7: DA7.7(B) FU18.1(IN/OUT) R76.2 VD22.2(A2) VD23.1(A1)
NetDA7_8: DA7.8(A) FU16.1(IN/OUT) R76.1 VD21.1(A1) VD22.1(A1)
NetDA8_2: DA8.2(RO) DD7.1(1A)
NetDA8_7: DA8.7(B) FU20.1(IN/OUT) R79.2 VD25.2(A2) VD26.1(A1)
NetDA8_8: DA8.8(A) FU19.1(IN/OUT) R79.1 VD24.1(A1) VD25.1(A1)
NetDD6_4: DD6.4(2Y) R74.1
NetDD6_6: DD6.6(1Y) R73.1
NetDD7_4: DD7.4(2Y) R78.1
NetDD7_6: DD7.6(1Y) R77.1
NetFU12_2: FU12.2 X7.1
NetFU17_2: FU17.2 X8.1

Not connected (* = marked no-connect by the designer): DA5 5(Y)* 6(Z)*; DA6 5(Y)* 6(Z)*; DA7 5(Y)* 6(Z)*; DA8 5(Y)* 6(Z)*

### Notes on the sheet
- Подп. и дата
- Инв. № дубл.
- Взам. инв. №
- Инв. № подл.
- Лист
- Изм.
- № докум.
- Подп.
- Дата
- Копировал
- Формат А3

### Library data of the parts
C73 C76 C78 C81 = CL10A475KO8NNNC: as C11 on sheet MCU; Артикул: CL10A475KO8NNNC; Номинал: 4.7uF; Строка для документации: https://mm.digikey.com/Volume0/opasdata/d220001/medias/docus/2328/CL10A475KO8NNNC_Spec.pdf; Тип элемента: Конденсатор
C74 C75 C77 C79 C80 C82 = CL10B104KB8NNNC: as C3 on sheet MCU; Артикул: CL10B104KB8NNNC; Номинал: 0.1uF; Строка для документации: https://mm.digikey.com/Volume0/opasdata/d220001/medias/docus/609/CL10B104KB8NNNC_Spec.pdf; Тип элемента: Конденсатор
DA5-DA8 = ADM4857ARZ: as DA2 on sheet ABS_ENC_IF; Артикул: ADM4857ARZ; Строка для документации: https://www.analog.com/media/en/technical-documentation/data-sheets/ADM4850_4851_4852_4853_4854_4855_4856_4857.pdf; Тип элемента: Микросхема
DD6 DD7 = 74LVC2G17GW,125: as DD5 on sheet ABS_ENC_IF; Артикул: 74LVC2G17GW,125; Строка для документации: https://assets.nexperia.com/documents/data-sheet/74LVC2G17.pdf; Тип элемента: Микросхема
FU11 FU13-FU16 FU18-FU20 = TBU-CA065-200-WH: as FU1 on sheet ABS_ENC_IF; Артикул: TBU-CA065-200-WH; Ток: 200mA; Строка для документации: https://www.bourns.com/docs/Product-Datasheets/TBU-CA.pdf; Тип элемента: Предохранитель
FU12 FU17 = MF-MSMF030-2: as FU2 on sheet ABS_ENC_IF; Артикул: MF-MSMF030-2; Ток: 300mA; Строка для документации: https://www.bourns.com/docs/product-datasheets/mf-msmf.pdf; Тип элемента: Предохранитель
R72 R75 R76 R79 = RC0805FR-07120RL: as R58 on sheet ABS_ENC_IF; Артикул: RC0805FR-07120RL; Номинал: 120; Строка для документации: https://www.yageo.com/upload/media/product/productsearch/datasheet/rchip/PYu-RC_Group_51_RoHS_L_12.pdf; Тип элемента: Резистор
R73 R74 R77 R78 = RC0603FR-0733RL: as R18 on sheet DRIVER_A; Артикул: RC0603FR-0733RL; Номинал: 33; Строка для документации: https://www.yageo.com/upload/media/product/app/datasheet/rchip/pyu-rc_group_51_rohs_l.pdf; Тип элемента: Резистор
VD15 VD17 VD18 VD20 VD21 VD23 VD24 VD26 = SMBJ5.0CA-TR: as VD1 on sheet ABS_ENC_IF; Артикул: SMBJ5.0CA-TR; Строка для документации: https://www.st.com/content/ccc/resource/technical/document/datasheet/19/78/91/39/07/cd/40/65/CD00001366.pdf/files/CD00001366.pdf/_jcr_content/translations/en.CD00001366.pdf
VD16 VD19 VD22 VD25 = SMBJ12CA-TR: as VD2 on sheet ABS_ENC_IF; Артикул: SMBJ12CA-TR; Строка для документации: https://www.st.com/content/ccc/resource/technical/document/datasheet/19/78/91/39/07/cd/40/65/CD00001366.pdf/files/CD00001366.pdf/_jcr_content/translations/en.CD00001366.pdf
X7 X8 = DG141V-2.54-06P-14-00A(H): Разъем, 6 контактов; Тип разъема: Push-Button terminal block; Количество контактов: 6; Шаг контактов: 2.54mm; Ток: 2A; Напряжение: 150V; Производитель: Degson Electronics; Описание: 6 Position Wire to Board Terminal Block Vertical with Board 0.100" (2.54mm) Through Hole; Температурный диапазон: -40°C ~ 105°C; Вид монтажа: Through Hole; Артикул: DG141V-2.54-06P-14-00A(H); Строка для документации: https://static.chipdip.ru/lib/874/DOC000874680.pdf; Тип элемента: Разъем